# Altium project NA61_BPD_FEE.PrjPcb (part 3 of 4)
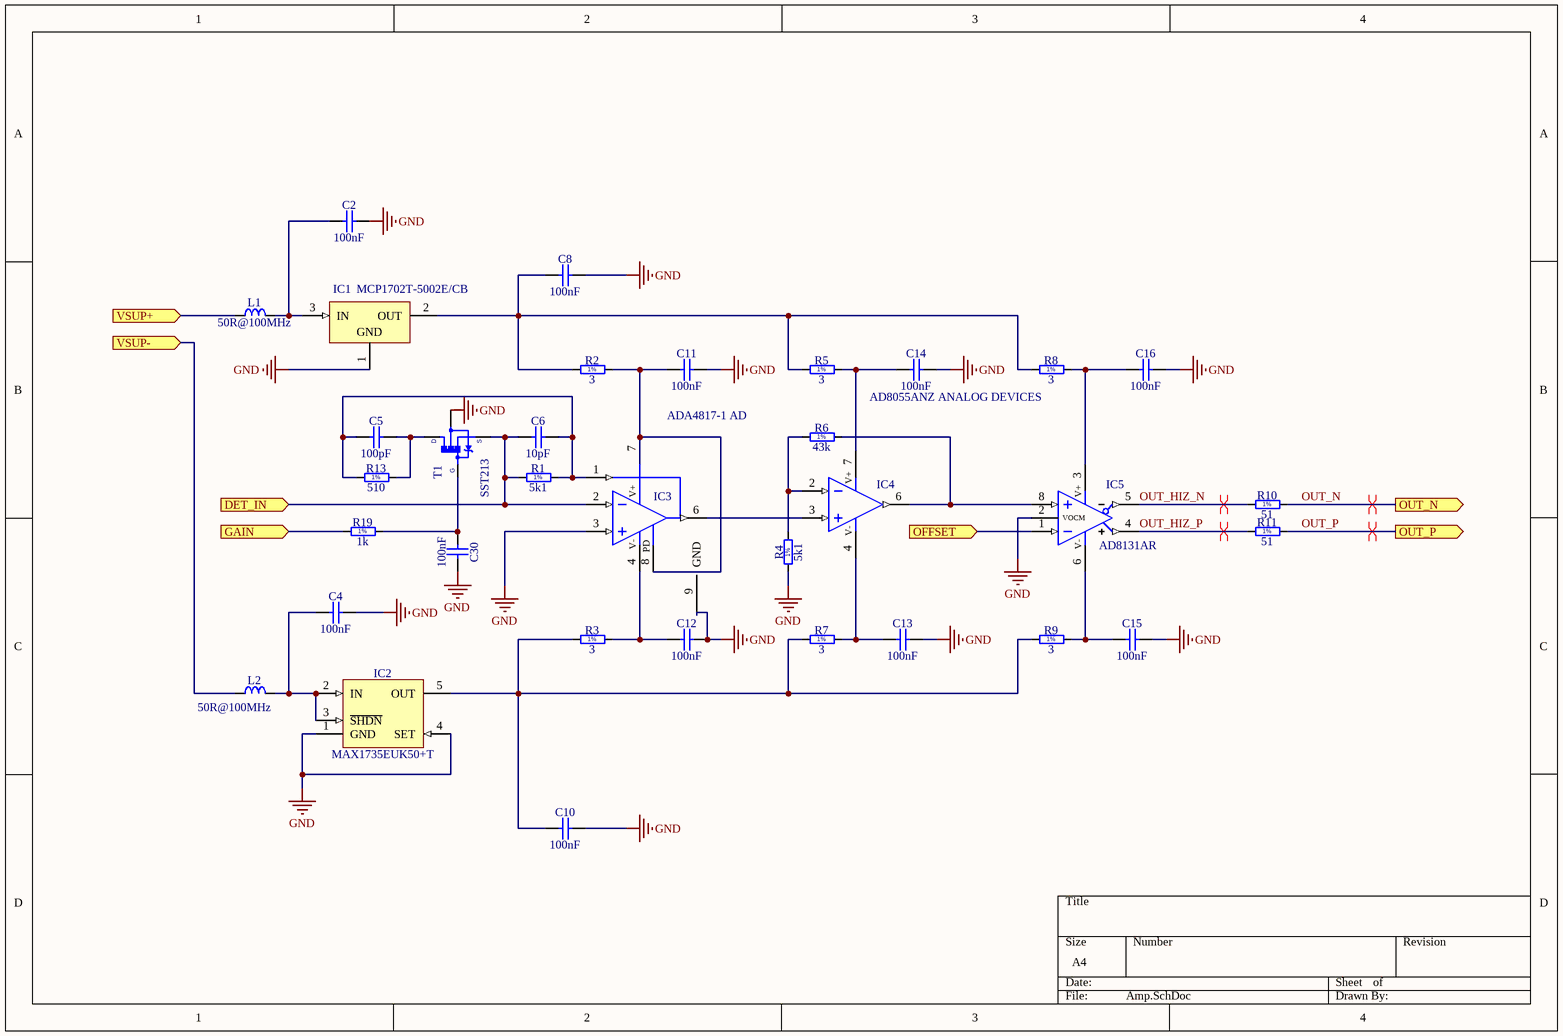
[diagram p3: Amp.SchDoc]
## Nets that join several sheets
CHASSIS: Main (22 pins), U_Bank1 (7 pins), U_Bank2 (7 pins), U_Bank3 (7 pins), U_Bank4 (7 pins), U_Bank5 (7 pins), U_Bank6 (7 pins), U_Bank7 (7 pins), U_Bank8 (7 pins), U_Bank9 (7 pins), U_Bank10 (7 pins), U_Bank11 (7 pins), U_Bank12 (7 pins), U_Bank13 (7 pins), U_Bank14 (7 pins), U_Bank15 (7 pins), U_Bank16 (7 pins), U_Bank17 (7 pins), U_Bank18 (7 pins), U_Bank19 (7 pins), U_Bank20 (7 pins)
GND: Main (51 pins), U_Bank1 (C18_U_Bank1.2 C19_U_Bank1.1 IC6_U_Bank1.4), U_Bank1/U_Amp (19 pins), U_Bank1/U_Amp (19 pins), U_Bank1/U_Amp (19 pins), U_Bank1/U_Amp (19 pins), U_Bank1/U_Amp (19 pins), U_Bank2 (C18_U_Bank2.2 C19_U_Bank2.1 IC6_U_Bank2.4), U_Bank2/U_Amp (19 pins), U_Bank2/U_Amp (19 pins), U_Bank2/U_Amp (19 pins), U_Bank2/U_Amp (19 pins), U_Bank2/U_Amp (19 pins), U_Bank3 (C18_U_Bank3.2 C19_U_Bank3.1 IC6_U_Bank3.4), U_Bank3/U_Amp (19 pins), U_Bank3/U_Amp (19 pins), U_Bank3/U_Amp (19 pins), U_Bank3/U_Amp (19 pins), U_Bank3/U_Amp (19 pins), U_Bank4 (C18_U_Bank4.2 C19_U_Bank4.1 IC6_U_Bank4.4), U_Bank4/U_Amp (19 pins), U_Bank4/U_Amp (19 pins), U_Bank4/U_Amp (19 pins), U_Bank4/U_Amp (19 pins), U_Bank4/U_Amp (19 pins), U_Bank5 (C18_U_Bank5.2 C19_U_Bank5.1 IC6_U_Bank5.4), U_Bank5/U_Amp (19 pins), U_Bank5/U_Amp (19 pins), U_Bank5/U_Amp (19 pins), U_Bank5/U_Amp (19 pins), U_Bank5/U_Amp (19 pins), U_Bank6 (C18_U_Bank6.2 C19_U_Bank6.1 IC6_U_Bank6.4), U_Bank6/U_Amp (19 pins), U_Bank6/U_Amp (19 pins), U_Bank6/U_Amp (19 pins), U_Bank6/U_Amp (19 pins), U_Bank6/U_Amp (19 pins), U_Bank7 (C18_U_Bank7.2 C19_U_Bank7.1 IC6_U_Bank7.4), U_Bank7/U_Amp (19 pins), U_Bank7/U_Amp (19 pins), U_Bank7/U_Amp (19 pins), U_Bank7/U_Amp (19 pins), U_Bank7/U_Amp (19 pins), U_Bank8 (C18_U_Bank8.2 C19_U_Bank8.1 IC6_U_Bank8.4), U_Bank8/U_Amp (19 pins), U_Bank8/U_Amp (19 pins), U_Bank8/U_Amp (19 pins), U_Bank8/U_Amp (19 pins), U_Bank8/U_Amp (19 pins), U_Bank9 (C18_U_Bank9.2 C19_U_Bank9.1 IC6_U_Bank9.4), U_Bank9/U_Amp (19 pins), U_Bank9/U_Amp (19 pins), U_Bank9/U_Amp (19 pins), U_Bank9/U_Amp (19 pins), U_Bank9/U_Amp (19 pins), U_Bank10 (C18_U_Bank10.2 C19_U_Bank10.1 IC6_U_Bank10.4), U_Bank10/U_Amp (19 pins), U_Bank10/U_Amp (19 pins), U_Bank10/U_Amp (19 pins), U_Bank10/U_Amp (19 pins), U_Bank10/U_Amp (19 pins), U_Bank11 (C18_U_Bank11.2 C19_U_Bank11.1 IC6_U_Bank11.4), U_Bank11/U_Amp (19 pins), U_Bank11/U_Amp (19 pins), U_Bank11/U_Amp (19 pins), U_Bank11/U_Amp (19 pins), U_Bank11/U_Amp (19 pins), U_Bank12 (C18_U_Bank12.2 C19_U_Bank12.1 IC6_U_Bank12.4), U_Bank12/U_Amp (19 pins), U_Bank12/U_Amp (19 pins), U_Bank12/U_Amp (19 pins), U_Bank12/U_Amp (19 pins), U_Bank12/U_Amp (19 pins), U_Bank13 (C18_U_Bank13.2 C19_U_Bank13.1 IC6_U_Bank13.4), U_Bank13/U_Amp (19 pins), U_Bank13/U_Amp (19 pins), U_Bank13/U_Amp (19 pins), U_Bank13/U_Amp (19 pins), U_Bank13/U_Amp (19 pins), U_Bank14 (C18_U_Bank14.2 C19_U_Bank14.1 IC6_U_Bank14.4), U_Bank14/U_Amp (19 pins), U_Bank14/U_Amp (19 pins), U_Bank14/U_Amp (19 pins), U_Bank14/U_Amp (19 pins), U_Bank14/U_Amp (19 pins), U_Bank15 (C18_U_Bank15.2 C19_U_Bank15.1 IC6_U_Bank15.4), U_Bank15/U_Amp (19 pins), U_Bank15/U_Amp (19 pins), U_Bank15/U_Amp (19 pins), U_Bank15/U_Amp (19 pins), U_Bank15/U_Amp (19 pins), U_Bank16 (C18_U_Bank16.2 C19_U_Bank16.1 IC6_U_Bank16.4), U_Bank16/U_Amp (19 pins), U_Bank16/U_Amp (19 pins), U_Bank16/U_Amp (19 pins), U_Bank16/U_Amp (19 pins), U_Bank16/U_Amp (19 pins), U_Bank17 (C18_U_Bank17.2 C19_U_Bank17.1 IC6_U_Bank17.4), U_Bank17/U_Amp (19 pins), U_Bank17/U_Amp (19 pins), U_Bank17/U_Amp (19 pins), U_Bank17/U_Amp (19 pins), U_Bank17/U_Amp (19 pins), U_Bank18 (C18_U_Bank18.2 C19_U_Bank18.1 IC6_U_Bank18.4), U_Bank18/U_Amp (19 pins), U_Bank18/U_Amp (19 pins), U_Bank18/U_Amp (19 pins), U_Bank18/U_Amp (19 pins), U_Bank18/U_Amp (19 pins), U_Bank19 (C18_U_Bank19.2 C19_U_Bank19.1 IC6_U_Bank19.4), U_Bank19/U_Amp (19 pins), U_Bank19/U_Amp (19 pins), U_Bank19/U_Amp (19 pins), U_Bank19/U_Amp (19 pins), U_Bank19/U_Amp (19 pins), U_Bank20 (C18_U_Bank20.2 C19_U_Bank20.1 IC6_U_Bank20.4), U_Bank20/U_Amp (19 pins), U_Bank20/U_Amp (19 pins), U_Bank20/U_Amp (19 pins), U_Bank20/U_Amp (19 pins), U_Bank20/U_Amp (19 pins)
+VSUP: Main (9 pins), U_Bank1 (C18_U_Bank1.1 IC6_U_Bank1.7), U_Bank1/U_Amp (L1_U_Amp5.1), U_Bank1/U_Amp (L1_U_Amp4.1), U_Bank1/U_Amp (L1_U_Amp3.1), U_Bank1/U_Amp (L1_U_Amp2.1), U_Bank1/U_Amp (L1_U_Amp1.1), U_Bank2 (C18_U_Bank2.1 IC6_U_Bank2.7), U_Bank2/U_Amp (L1_U_Bank2_U_Amp#1.1), U_Bank2/U_Amp (L1_U_Bank2_U_Amp#2.1), U_Bank2/U_Amp (L1_U_Bank2_U_Amp#3.1), U_Bank2/U_Amp (L1_U_Bank2_U_Amp#4.1), U_Bank2/U_Amp (L1_U_Bank2_U_Amp#5.1), U_Bank3 (C18_U_Bank3.1 IC6_U_Bank3.7), U_Bank3/U_Amp (L1_U_Bank3_U_Amp#1.1), U_Bank3/U_Amp (L1_U_Bank3_U_Amp#2.1), U_Bank3/U_Amp (L1_U_Bank3_U_Amp#3.1), U_Bank3/U_Amp (L1_U_Bank3_U_Amp#4.1), U_Bank3/U_Amp (L1_U_Bank3_U_Amp#5.1), U_Bank4 (C18_U_Bank4.1 IC6_U_Bank4.7), U_Bank4/U_Amp (L1_U_Bank4_U_Amp#1.1), U_Bank4/U_Amp (L1_U_Bank4_U_Amp#2.1), U_Bank4/U_Amp (L1_U_Bank4_U_Amp#3.1), U_Bank4/U_Amp (L1_U_Bank4_U_Amp#4.1), U_Bank4/U_Amp (L1_U_Bank4_U_Amp#5.1), U_Bank5 (C18_U_Bank5.1 IC6_U_Bank5.7), U_Bank5/U_Amp (L1_U_Bank5_U_Amp#1.1), U_Bank5/U_Amp (L1_U_Bank5_U_Amp#2.1), U_Bank5/U_Amp (L1_U_Bank5_U_Amp#3.1), U_Bank5/U_Amp (L1_U_Bank5_U_Amp#4.1), U_Bank5/U_Amp (L1_U_Bank5_U_Amp#5.1), U_Bank6 (C18_U_Bank6.1 IC6_U_Bank6.7), U_Bank6/U_Amp (L1_U_Bank6_U_Amp#1.1), U_Bank6/U_Amp (L1_U_Bank6_U_Amp#2.1), U_Bank6/U_Amp (L1_U_Bank6_U_Amp#3.1), U_Bank6/U_Amp (L1_U_Bank6_U_Amp#4.1), U_Bank6/U_Amp (L1_U_Bank6_U_Amp#5.1), U_Bank7 (C18_U_Bank7.1 IC6_U_Bank7.7), U_Bank7/U_Amp (L1_U_Bank7_U_Amp#1.1), U_Bank7/U_Amp (L1_U_Bank7_U_Amp#2.1), U_Bank7/U_Amp (L1_U_Bank7_U_Amp#3.1), U_Bank7/U_Amp (L1_U_Bank7_U_Amp#4.1), U_Bank7/U_Amp (L1_U_Bank7_U_Amp#5.1), U_Bank8 (C18_U_Bank8.1 IC6_U_Bank8.7), U_Bank8/U_Amp (L1_U_Bank8_U_Amp#1.1), U_Bank8/U_Amp (L1_U_Bank8_U_Amp#2.1), U_Bank8/U_Amp (L1_U_Bank8_U_Amp#3.1), U_Bank8/U_Amp (L1_U_Bank8_U_Amp#4.1), U_Bank8/U_Amp (L1_U_Bank8_U_Amp#5.1), U_Bank9 (C18_U_Bank9.1 IC6_U_Bank9.7), U_Bank9/U_Amp (L1_U_Bank9_U_Amp#1.1), U_Bank9/U_Amp (L1_U_Bank9_U_Amp#2.1), U_Bank9/U_Amp (L1_U_Bank9_U_Amp#3.1), U_Bank9/U_Amp (L1_U_Bank9_U_Amp#4.1), U_Bank9/U_Amp (L1_U_Bank9_U_Amp#5.1), U_Bank10 (C18_U_Bank10.1 IC6_U_Bank10.7), U_Bank10/U_Amp (L1_U_Bank10_U_Amp#1.1), U_Bank10/U_Amp (L1_U_Bank10_U_Amp#2.1), U_Bank10/U_Amp (L1_U_Bank10_U_Amp#3.1), U_Bank10/U_Amp (L1_U_Bank10_U_Amp#4.1), U_Bank10/U_Amp (L1_U_Bank10_U_Amp#5.1), U_Bank11 (C18_U_Bank11.1 IC6_U_Bank11.7), U_Bank11/U_Amp (L1_U_Bank11_U_Amp#1.1), U_Bank11/U_Amp (L1_U_Bank11_U_Amp#2.1), U_Bank11/U_Amp (L1_U_Bank11_U_Amp#3.1), U_Bank11/U_Amp (L1_U_Bank11_U_Amp#4.1), U_Bank11/U_Amp (L1_U_Bank11_U_Amp#5.1), U_Bank12 (C18_U_Bank12.1 IC6_U_Bank12.7), U_Bank12/U_Amp (L1_U_Bank12_U_Amp#1.1), U_Bank12/U_Amp (L1_U_Bank12_U_Amp#2.1), U_Bank12/U_Amp (L1_U_Bank12_U_Amp#3.1), U_Bank12/U_Amp (L1_U_Bank12_U_Amp#4.1), U_Bank12/U_Amp (L1_U_Bank12_U_Amp#5.1), U_Bank13 (C18_U_Bank13.1 IC6_U_Bank13.7), U_Bank13/U_Amp (L1_U_Bank13_U_Amp#1.1), U_Bank13/U_Amp (L1_U_Bank13_U_Amp#2.1), U_Bank13/U_Amp (L1_U_Bank13_U_Amp#3.1), U_Bank13/U_Amp (L1_U_Bank13_U_Amp#4.1), U_Bank13/U_Amp (L1_U_Bank13_U_Amp#5.1), U_Bank14 (C18_U_Bank14.1 IC6_U_Bank14.7), U_Bank14/U_Amp (L1_U_Bank14_U_Amp#1.1), U_Bank14/U_Amp (L1_U_Bank14_U_Amp#2.1), U_Bank14/U_Amp (L1_U_Bank14_U_Amp#3.1), U_Bank14/U_Amp (L1_U_Bank14_U_Amp#4.1), U_Bank14/U_Amp (L1_U_Bank14_U_Amp#5.1), U_Bank15 (C18_U_Bank15.1 IC6_U_Bank15.7), U_Bank15/U_Amp (L1_U_Bank15_U_Amp#1.1), U_Bank15/U_Amp (L1_U_Bank15_U_Amp#2.1), U_Bank15/U_Amp (L1_U_Bank15_U_Amp#3.1), U_Bank15/U_Amp (L1_U_Bank15_U_Amp#4.1), U_Bank15/U_Amp (L1_U_Bank15_U_Amp#5.1), U_Bank16 (C18_U_Bank16.1 IC6_U_Bank16.7), U_Bank16/U_Amp (L1_U_Bank16_U_Amp#1.1), U_Bank16/U_Amp (L1_U_Bank16_U_Amp#2.1), U_Bank16/U_Amp (L1_U_Bank16_U_Amp#3.1), U_Bank16/U_Amp (L1_U_Bank16_U_Amp#4.1), U_Bank16/U_Amp (L1_U_Bank16_U_Amp#5.1), U_Bank17 (C18_U_Bank17.1 IC6_U_Bank17.7), U_Bank17/U_Amp (L1_U_Bank17_U_Amp#1.1), U_Bank17/U_Amp (L1_U_Bank17_U_Amp#2.1), U_Bank17/U_Amp (L1_U_Bank17_U_Amp#3.1), U_Bank17/U_Amp (L1_U_Bank17_U_Amp#4.1), U_Bank17/U_Amp (L1_U_Bank17_U_Amp#5.1), U_Bank18 (C18_U_Bank18.1 IC6_U_Bank18.7), U_Bank18/U_Amp (L1_U_Bank18_U_Amp#1.1), U_Bank18/U_Amp (L1_U_Bank18_U_Amp#2.1), U_Bank18/U_Amp (L1_U_Bank18_U_Amp#3.1), U_Bank18/U_Amp (L1_U_Bank18_U_Amp#4.1), U_Bank18/U_Amp (L1_U_Bank18_U_Amp#5.1), U_Bank19 (C18_U_Bank19.1 IC6_U_Bank19.7), U_Bank19/U_Amp (L1_U_Bank19_U_Amp#1.1), U_Bank19/U_Amp (L1_U_Bank19_U_Amp#2.1), U_Bank19/U_Amp (L1_U_Bank19_U_Amp#3.1), U_Bank19/U_Amp (L1_U_Bank19_U_Amp#4.1), U_Bank19/U_Amp (L1_U_Bank19_U_Amp#5.1), U_Bank20 (C18_U_Bank20.1 IC6_U_Bank20.7), U_Bank20/U_Amp (L1_U_Bank20_U_Amp#1.1), U_Bank20/U_Amp (L1_U_Bank20_U_Amp#2.1), U_Bank20/U_Amp (L1_U_Bank20_U_Amp#3.1), U_Bank20/U_Amp (L1_U_Bank20_U_Amp#4.1), U_Bank20/U_Amp (L1_U_Bank20_U_Amp#5.1)
-VSUP: Main (7 pins), U_Bank1/U_Amp (L2_U_Amp5.1), U_Bank1/U_Amp (L2_U_Amp4.1), U_Bank1/U_Amp (L2_U_Amp3.1), U_Bank1/U_Amp (L2_U_Amp2.1), U_Bank1/U_Amp (L2_U_Amp1.1), U_Bank2/U_Amp (L2_U_Bank2_U_Amp#1.1), U_Bank2/U_Amp (L2_U_Bank2_U_Amp#2.1), U_Bank2/U_Amp (L2_U_Bank2_U_Amp#3.1), U_Bank2/U_Amp (L2_U_Bank2_U_Amp#4.1), U_Bank2/U_Amp (L2_U_Bank2_U_Amp#5.1), U_Bank3/U_Amp (L2_U_Bank3_U_Amp#1.1), U_Bank3/U_Amp (L2_U_Bank3_U_Amp#2.1), U_Bank3/U_Amp (L2_U_Bank3_U_Amp#3.1), U_Bank3/U_Amp (L2_U_Bank3_U_Amp#4.1), U_Bank3/U_Amp (L2_U_Bank3_U_Amp#5.1), U_Bank4/U_Amp (L2_U_Bank4_U_Amp#1.1), U_Bank4/U_Amp (L2_U_Bank4_U_Amp#2.1), U_Bank4/U_Amp (L2_U_Bank4_U_Amp#3.1), U_Bank4/U_Amp (L2_U_Bank4_U_Amp#4.1), U_Bank4/U_Amp (L2_U_Bank4_U_Amp#5.1), U_Bank5/U_Amp (L2_U_Bank5_U_Amp#1.1), U_Bank5/U_Amp (L2_U_Bank5_U_Amp#2.1), U_Bank5/U_Amp (L2_U_Bank5_U_Amp#3.1), U_Bank5/U_Amp (L2_U_Bank5_U_Amp#4.1), U_Bank5/U_Amp (L2_U_Bank5_U_Amp#5.1), U_Bank6/U_Amp (L2_U_Bank6_U_Amp#1.1), U_Bank6/U_Amp (L2_U_Bank6_U_Amp#2.1), U_Bank6/U_Amp (L2_U_Bank6_U_Amp#3.1), U_Bank6/U_Amp (L2_U_Bank6_U_Amp#4.1), U_Bank6/U_Amp (L2_U_Bank6_U_Amp#5.1), U_Bank7/U_Amp (L2_U_Bank7_U_Amp#1.1), U_Bank7/U_Amp (L2_U_Bank7_U_Amp#2.1), U_Bank7/U_Amp (L2_U_Bank7_U_Amp#3.1), U_Bank7/U_Amp (L2_U_Bank7_U_Amp#4.1), U_Bank7/U_Amp (L2_U_Bank7_U_Amp#5.1), U_Bank8/U_Amp (L2_U_Bank8_U_Amp#1.1), U_Bank8/U_Amp (L2_U_Bank8_U_Amp#2.1), U_Bank8/U_Amp (L2_U_Bank8_U_Amp#3.1), U_Bank8/U_Amp (L2_U_Bank8_U_Amp#4.1), U_Bank8/U_Amp (L2_U_Bank8_U_Amp#5.1), U_Bank9/U_Amp (L2_U_Bank9_U_Amp#1.1), U_Bank9/U_Amp (L2_U_Bank9_U_Amp#2.1), U_Bank9/U_Amp (L2_U_Bank9_U_Amp#3.1), U_Bank9/U_Amp (L2_U_Bank9_U_Amp#4.1), U_Bank9/U_Amp (L2_U_Bank9_U_Amp#5.1), U_Bank10/U_Amp (L2_U_Bank10_U_Amp#1.1), U_Bank10/U_Amp (L2_U_Bank10_U_Amp#2.1), U_Bank10/U_Amp (L2_U_Bank10_U_Amp#3.1), U_Bank10/U_Amp (L2_U_Bank10_U_Amp#4.1), U_Bank10/U_Amp (L2_U_Bank10_U_Amp#5.1), U_Bank11/U_Amp (L2_U_Bank11_U_Amp#1.1), U_Bank11/U_Amp (L2_U_Bank11_U_Amp#2.1), U_Bank11/U_Amp (L2_U_Bank11_U_Amp#3.1), U_Bank11/U_Amp (L2_U_Bank11_U_Amp#4.1), U_Bank11/U_Amp (L2_U_Bank11_U_Amp#5.1), U_Bank12/U_Amp (L2_U_Bank12_U_Amp#1.1), U_Bank12/U_Amp (L2_U_Bank12_U_Amp#2.1), U_Bank12/U_Amp (L2_U_Bank12_U_Amp#3.1), U_Bank12/U_Amp (L2_U_Bank12_U_Amp#4.1), U_Bank12/U_Amp (L2_U_Bank12_U_Amp#5.1), U_Bank13/U_Amp (L2_U_Bank13_U_Amp#1.1), U_Bank13/U_Amp (L2_U_Bank13_U_Amp#2.1), U_Bank13/U_Amp (L2_U_Bank13_U_Amp#3.1), U_Bank13/U_Amp (L2_U_Bank13_U_Amp#4.1), U_Bank13/U_Amp (L2_U_Bank13_U_Amp#5.1), U_Bank14/U_Amp (L2_U_Bank14_U_Amp#1.1), U_Bank14/U_Amp (L2_U_Bank14_U_Amp#2.1), U_Bank14/U_Amp (L2_U_Bank14_U_Amp#3.1), U_Bank14/U_Amp (L2_U_Bank14_U_Amp#4.1), U_Bank14/U_Amp (L2_U_Bank14_U_Amp#5.1), U_Bank15/U_Amp (L2_U_Bank15_U_Amp#1.1), U_Bank15/U_Amp (L2_U_Bank15_U_Amp#2.1), U_Bank15/U_Amp (L2_U_Bank15_U_Amp#3.1), U_Bank15/U_Amp (L2_U_Bank15_U_Amp#4.1), U_Bank15/U_Amp (L2_U_Bank15_U_Amp#5.1), U_Bank16/U_Amp (L2_U_Bank16_U_Amp#1.1), U_Bank16/U_Amp (L2_U_Bank16_U_Amp#2.1), U_Bank16/U_Amp (L2_U_Bank16_U_Amp#3.1), U_Bank16/U_Amp (L2_U_Bank16_U_Amp#4.1), U_Bank16/U_Amp (L2_U_Bank16_U_Amp#5.1), U_Bank17/U_Amp (L2_U_Bank17_U_Amp#1.1), U_Bank17/U_Amp (L2_U_Bank17_U_Amp#2.1), U_Bank17/U_Amp (L2_U_Bank17_U_Amp#3.1), U_Bank17/U_Amp (L2_U_Bank17_U_Amp#4.1), U_Bank17/U_Amp (L2_U_Bank17_U_Amp#5.1), U_Bank18/U_Amp (L2_U_Bank18_U_Amp#1.1), U_Bank18/U_Amp (L2_U_Bank18_U_Amp#2.1), U_Bank18/U_Amp (L2_U_Bank18_U_Amp#3.1), U_Bank18/U_Amp (L2_U_Bank18_U_Amp#4.1), U_Bank18/U_Amp (L2_U_Bank18_U_Amp#5.1), U_Bank19/U_Amp (L2_U_Bank19_U_Amp#1.1), U_Bank19/U_Amp (L2_U_Bank19_U_Amp#2.1), U_Bank19/U_Amp (L2_U_Bank19_U_Amp#3.1), U_Bank19/U_Amp (L2_U_Bank19_U_Amp#4.1), U_Bank19/U_Amp (L2_U_Bank19_U_Amp#5.1), U_Bank20/U_Amp (L2_U_Bank20_U_Amp#1.1), U_Bank20/U_Amp (L2_U_Bank20_U_Amp#2.1), U_Bank20/U_Amp (L2_U_Bank20_U_Amp#3.1), U_Bank20/U_Amp (L2_U_Bank20_U_Amp#4.1), U_Bank20/U_Amp (L2_U_Bank20_U_Amp#5.1)
DET_IN_A: Main (XP1.91), U_Bank1/U_Amp (C6_U_Amp5.1 IC3_U_Amp5.2 R1_U_Amp5.1 T1_U_Amp5.2)
DET_IN_A: Main (XP1.17), U_Bank2/U_Amp (C6_U_Bank2_U_Amp#1.1 IC3_U_Bank2_U_Amp#1.2 R1_U_Bank2_U_Amp#1.1 T1_U_Bank2_U_Amp#1.2)
DET_IN_A: Main (XP1.82), U_Bank3/U_Amp (C6_U_Bank3_U_Amp#1.1 IC3_U_Bank3_U_Amp#1.2 R1_U_Bank3_U_Amp#1.1 T1_U_Bank3_U_Amp#1.2)
DET_IN_A: Main (XP1.12), U_Bank4/U_Amp (C6_U_Bank4_U_Amp#1.1 IC3_U_Bank4_U_Amp#1.2 R1_U_Bank4_U_Amp#1.1 T1_U_Bank4_U_Amp#1.2)
DET_IN_A: Main (XP1.49), U_Bank5/U_Amp (C6_U_Bank5_U_Amp#1.1 IC3_U_Bank5_U_Amp#1.2 R1_U_Bank5_U_Amp#1.1 T1_U_Bank5_U_Amp#1.2)
DET_IN_A: Main (XP1.31), U_Bank6/U_Amp (C6_U_Bank6_U_Amp#1.1 IC3_U_Bank6_U_Amp#1.2 R1_U_Bank6_U_Amp#1.1 T1_U_Bank6_U_Amp#1.2)
DET_IN_A: Main (XP1.69), U_Bank7/U_Amp (C6_U_Bank7_U_Amp#1.1 IC3_U_Bank7_U_Amp#1.2 R1_U_Bank7_U_Amp#1.1 T1_U_Bank7_U_Amp#1.2)
DET_IN_A: Main (XP1.6), U_Bank8/U_Amp (C6_U_Bank8_U_Amp#1.1 IC3_U_Bank8_U_Amp#1.2 R1_U_Bank8_U_Amp#1.1 T1_U_Bank8_U_Amp#1.2)
DET_IN_A: Main (XP1.97), U_Bank9/U_Amp (C6_U_Bank9_U_Amp#1.1 IC3_U_Bank9_U_Amp#1.2 R1_U_Bank9_U_Amp#1.1 T1_U_Bank9_U_Amp#1.2)
DET_IN_A: Main (XP1.1), U_Bank10/U_Amp (C6_U_Bank10_U_Amp#1.1 IC3_U_Bank10_U_Amp#1.2 R1_U_Bank10_U_Amp#1.1 T1_U_Bank10_U_Amp#1.2)
DET_IN_A: Main (XP1.41), U_Bank11/U_Amp (C6_U_Bank11_U_Amp#1.1 IC3_U_Bank11_U_Amp#1.2 R1_U_Bank11_U_Amp#1.1 T1_U_Bank11_U_Amp#1.2)
DET_IN_A: Main (XP1.40), U_Bank12/U_Amp (C6_U_Bank12_U_Amp#1.1 IC3_U_Bank12_U_Amp#1.2 R1_U_Bank12_U_Amp#1.1 T1_U_Bank12_U_Amp#1.2)
DET_IN_A: Main (XP1.36), U_Bank13/U_Amp (C6_U_Bank13_U_Amp#1.1 IC3_U_Bank13_U_Amp#1.2 R1_U_Bank13_U_Amp#1.1 T1_U_Bank13_U_Amp#1.2)
DET_IN_A: Main (XP1.35), U_Bank14/U_Amp (C6_U_Bank14_U_Amp#1.1 IC3_U_Bank14_U_Amp#1.2 R1_U_Bank14_U_Amp#1.1 T1_U_Bank14_U_Amp#1.2)
DET_IN_A: Main (XP1.55), U_Bank15/U_Amp (C6_U_Bank15_U_Amp#1.1 IC3_U_Bank15_U_Amp#1.2 R1_U_Bank15_U_Amp#1.1 T1_U_Bank15_U_Amp#1.2)
DET_IN_A: Main (XP1.54), U_Bank16/U_Amp (C6_U_Bank16_U_Amp#1.1 IC3_U_Bank16_U_Amp#1.2 R1_U_Bank16_U_Amp#1.1 T1_U_Bank16_U_Amp#1.2)
DET_IN_A: Main (XP1.50), U_Bank17/U_Amp (C6_U_Bank17_U_Amp#1.1 IC3_U_Bank17_U_Amp#1.2 R1_U_Bank17_U_Amp#1.1 T1_U_Bank17_U_Amp#1.2)
DET_IN_A: Main (XP1.29), U_Bank18/U_Amp (C6_U_Bank18_U_Amp#1.1 IC3_U_Bank18_U_Amp#1.2 R1_U_Bank18_U_Amp#1.1 T1_U_Bank18_U_Amp#1.2)
DET_IN_A: Main (XP1.25), U_Bank19/U_Amp (C6_U_Bank19_U_Amp#1.1 IC3_U_Bank19_U_Amp#1.2 R1_U_Bank19_U_Amp#1.1 T1_U_Bank19_U_Amp#1.2)
DET_IN_A: Main (XP1.24), U_Bank20/U_Amp (C6_U_Bank20_U_Amp#1.1 IC3_U_Bank20_U_Amp#1.2 R1_U_Bank20_U_Amp#1.1 T1_U_Bank20_U_Amp#1.2)
DET_IN_B: Main (XP1.21), U_Bank1/U_Amp (C6_U_Amp4.1 IC3_U_Amp4.2 R1_U_Amp4.1 T1_U_Amp4.2)
DET_IN_B: Main (XP1.19), U_Bank2/U_Amp (C6_U_Bank2_U_Amp#2.1 IC3_U_Bank2_U_Amp#2.2 R1_U_Bank2_U_Amp#2.1 T1_U_Bank2_U_Amp#2.2)
DET_IN_B: Main (XP1.16), U_Bank3/U_Amp (C6_U_Bank3_U_Amp#2.1 IC3_U_Bank3_U_Amp#2.2 R1_U_Bank3_U_Amp#2.1 T1_U_Bank3_U_Amp#2.2)
DET_IN_B: Main (XP1.14), U_Bank4/U_Amp (C6_U_Bank4_U_Amp#2.1 IC3_U_Bank4_U_Amp#2.2 R1_U_Bank4_U_Amp#2.1 T1_U_Bank4_U_Amp#2.2)
DET_IN_B: Main (XP1.11), U_Bank5/U_Amp (C6_U_Bank5_U_Amp#2.1 IC3_U_Bank5_U_Amp#2.2 R1_U_Bank5_U_Amp#2.1 T1_U_Bank5_U_Amp#2.2)
DET_IN_B: Main (XP1.33), U_Bank6/U_Amp (C6_U_Bank6_U_Amp#2.1 IC3_U_Bank6_U_Amp#2.2 R1_U_Bank6_U_Amp#2.1 T1_U_Bank6_U_Amp#2.2)
DET_IN_B: Main (XP1.9), U_Bank7/U_Amp (C6_U_Bank7_U_Amp#2.1 IC3_U_Bank7_U_Amp#2.2 R1_U_Bank7_U_Amp#2.1 T1_U_Bank7_U_Amp#2.2)
DET_IN_B: Main (XP1.8), U_Bank8/U_Amp (C6_U_Bank8_U_Amp#2.1 IC3_U_Bank8_U_Amp#2.2 R1_U_Bank8_U_Amp#2.1 T1_U_Bank8_U_Amp#2.2)
DET_IN_B: Main (XP1.5), U_Bank9/U_Amp (C6_U_Bank9_U_Amp#2.1 IC3_U_Bank9_U_Amp#2.2 R1_U_Bank9_U_Amp#2.1 T1_U_Bank9_U_Amp#2.2)
DET_IN_B: Main (XP1.3), U_Bank10/U_Amp (C6_U_Bank10_U_Amp#2.1 IC3_U_Bank10_U_Amp#2.2 R1_U_Bank10_U_Amp#2.1 T1_U_Bank10_U_Amp#2.2)
DET_IN_B: Main (XP1.90), U_Bank11/U_Amp (C6_U_Bank11_U_Amp#2.1 IC3_U_Bank11_U_Amp#2.2 R1_U_Bank11_U_Amp#2.1 T1_U_Bank11_U_Amp#2.2)
DET_IN_B: Main (XP1.38), U_Bank12/U_Amp (C6_U_Bank12_U_Amp#2.1 IC3_U_Bank12_U_Amp#2.2 R1_U_Bank12_U_Amp#2.1 T1_U_Bank12_U_Amp#2.2)
DET_IN_B: Main (XP1.81), U_Bank13/U_Amp (C6_U_Bank13_U_Amp#2.1 IC3_U_Bank13_U_Amp#2.2 R1_U_Bank13_U_Amp#2.1 T1_U_Bank13_U_Amp#2.2)
DET_IN_B: Main (XP1.57), U_Bank14/U_Amp (C6_U_Bank14_U_Amp#2.1 IC3_U_Bank14_U_Amp#2.2 R1_U_Bank14_U_Amp#2.1 T1_U_Bank14_U_Amp#2.2)
DET_IN_B: Main (XP1.48), U_Bank15/U_Amp (C6_U_Bank15_U_Amp#2.1 IC3_U_Bank15_U_Amp#2.2 R1_U_Bank15_U_Amp#2.1 T1_U_Bank15_U_Amp#2.2)
DET_IN_B: Main (XP1.52), U_Bank16/U_Amp (C6_U_Bank16_U_Amp#2.1 IC3_U_Bank16_U_Amp#2.2 R1_U_Bank16_U_Amp#2.1 T1_U_Bank16_U_Amp#2.2)
DET_IN_B: Main (XP1.68), U_Bank17/U_Amp (C6_U_Bank17_U_Amp#2.1 IC3_U_Bank17_U_Amp#2.2 R1_U_Bank17_U_Amp#2.1 T1_U_Bank17_U_Amp#2.2)
DET_IN_B: Main (XP1.27), U_Bank18/U_Amp (C6_U_Bank18_U_Amp#2.1 IC3_U_Bank18_U_Amp#2.2 R1_U_Bank18_U_Amp#2.1 T1_U_Bank18_U_Amp#2.2)
DET_IN_B: Main (XP1.96), U_Bank19/U_Amp (C6_U_Bank19_U_Amp#2.1 IC3_U_Bank19_U_Amp#2.2 R1_U_Bank19_U_Amp#2.1 T1_U_Bank19_U_Amp#2.2)
DET_IN_B: Main (XP1.22), U_Bank20/U_Amp (C6_U_Bank20_U_Amp#2.1 IC3_U_Bank20_U_Amp#2.2 R1_U_Bank20_U_Amp#2.1 T1_U_Bank20_U_Amp#2.2)
DET_IN_C: Main (XP1.20), U_Bank1/U_Amp (C6_U_Amp3.1 IC3_U_Amp3.2 R1_U_Amp3.1 T1_U_Amp3.2)
DET_IN_C: Main (XP1.87), U_Bank2/U_Amp (C6_U_Bank2_U_Amp#3.1 IC3_U_Bank2_U_Amp#3.2 R1_U_Bank2_U_Amp#3.1 T1_U_Bank2_U_Amp#3.2)
DET_IN_C: Main (XP1.15), U_Bank3/U_Amp (C6_U_Bank3_U_Amp#3.1 IC3_U_Bank3_U_Amp#3.2 R1_U_Bank3_U_Amp#3.1 T1_U_Bank3_U_Amp#3.2)
DET_IN_C: Main (XP1.78), U_Bank4/U_Amp (C6_U_Bank4_U_Amp#3.1 IC3_U_Bank4_U_Amp#3.2 R1_U_Bank4_U_Amp#3.1 T1_U_Bank4_U_Amp#3.2)
DET_IN_C: Main (XP1.32), U_Bank5/U_Amp (C6_U_Bank5_U_Amp#3.1 IC3_U_Bank5_U_Amp#3.2 R1_U_Bank5_U_Amp#3.1 T1_U_Bank5_U_Amp#3.2)
DET_IN_C: Main (XP1.45), U_Bank6/U_Amp (C6_U_Bank6_U_Amp#3.1 IC3_U_Bank6_U_Amp#3.2 R1_U_Bank6_U_Amp#3.1 T1_U_Bank6_U_Amp#3.2)
DET_IN_C: Main (XP1.30), U_Bank7/U_Amp (C6_U_Bank7_U_Amp#3.1 IC3_U_Bank7_U_Amp#3.2 R1_U_Bank7_U_Amp#3.1 T1_U_Bank7_U_Amp#3.2)
DET_IN_C: Main (XP1.65), U_Bank8/U_Amp (C6_U_Bank8_U_Amp#3.1 IC3_U_Bank8_U_Amp#3.2 R1_U_Bank8_U_Amp#3.1 T1_U_Bank8_U_Amp#3.2)
DET_IN_C: Main (XP1.4), U_Bank9/U_Amp (C6_U_Bank9_U_Amp#3.1 IC3_U_Bank9_U_Amp#3.2 R1_U_Bank9_U_Amp#3.1 T1_U_Bank9_U_Amp#3.2)
DET_IN_C: Main (XP1.74), U_Bank10/U_Amp (C6_U_Bank10_U_Amp#3.1 IC3_U_Bank10_U_Amp#3.2 R1_U_Bank10_U_Amp#3.1 T1_U_Bank10_U_Amp#3.2)
DET_IN_C: Main (XP1.42), U_Bank11/U_Amp (C6_U_Bank11_U_Amp#3.1 IC3_U_Bank11_U_Amp#3.2 R1_U_Bank11_U_Amp#3.1 T1_U_Bank11_U_Amp#3.2)
DET_IN_C: Main (XP1.39), U_Bank12/U_Amp (C6_U_Bank12_U_Amp#3.1 IC3_U_Bank12_U_Amp#3.2 R1_U_Bank12_U_Amp#3.1 T1_U_Bank12_U_Amp#3.2)
DET_IN_C: Main (XP1.37), U_Bank13/U_Amp (C6_U_Bank13_U_Amp#3.1 IC3_U_Bank13_U_Amp#3.2 R1_U_Bank13_U_Amp#3.1 T1_U_Bank13_U_Amp#3.2)
DET_IN_C: Main (XP1.34), U_Bank14/U_Amp (C6_U_Bank14_U_Amp#3.1 IC3_U_Bank14_U_Amp#3.2 R1_U_Bank14_U_Amp#3.1 T1_U_Bank14_U_Amp#3.2)
DET_IN_C: Main (XP1.56), U_Bank15/U_Amp (C6_U_Bank15_U_Amp#3.1 IC3_U_Bank15_U_Amp#3.2 R1_U_Bank15_U_Amp#3.1 T1_U_Bank15_U_Amp#3.2)
DET_IN_C: Main (XP1.53), U_Bank16/U_Amp (C6_U_Bank16_U_Amp#3.1 IC3_U_Bank16_U_Amp#3.2 R1_U_Bank16_U_Amp#3.1 T1_U_Bank16_U_Amp#3.2)
DET_IN_C: Main (XP1.51), U_Bank17/U_Amp (C6_U_Bank17_U_Amp#3.1 IC3_U_Bank17_U_Amp#3.2 R1_U_Bank17_U_Amp#3.1 T1_U_Bank17_U_Amp#3.2)
DET_IN_C: Main (XP1.28), U_Bank18/U_Amp (C6_U_Bank18_U_Amp#3.1 IC3_U_Bank18_U_Amp#3.2 R1_U_Bank18_U_Amp#3.1 T1_U_Bank18_U_Amp#3.2)
DET_IN_C: Main (XP1.26), U_Bank19/U_Amp (C6_U_Bank19_U_Amp#3.1 IC3_U_Bank19_U_Amp#3.2 R1_U_Bank19_U_Amp#3.1 T1_U_Bank19_U_Amp#3.2)
DET_IN_C: Main (XP1.23), U_Bank20/U_Amp (C6_U_Bank20_U_Amp#3.1 IC3_U_Bank20_U_Amp#3.2 R1_U_Bank20_U_Amp#3.1 T1_U_Bank20_U_Amp#3.2)
DET_IN_D: Main (XP1.75), U_Bank1/U_Amp (C6_U_Amp2.1 IC3_U_Amp2.2 R1_U_Amp2.1 T1_U_Amp2.2)
DET_IN_D: Main (XP1.18), U_Bank2/U_Amp (C6_U_Bank2_U_Amp#4.1 IC3_U_Bank2_U_Amp#4.2 R1_U_Bank2_U_Amp#4.1 T1_U_Bank2_U_Amp#4.2)
DET_IN_D: Main (XP1.85), U_Bank3/U_Amp (C6_U_Bank3_U_Amp#4.1 IC3_U_Bank3_U_Amp#4.2 R1_U_Bank3_U_Amp#4.1 T1_U_Bank3_U_Amp#4.2)
DET_IN_D: Main (XP1.13), U_Bank4/U_Amp (C6_U_Bank4_U_Amp#4.1 IC3_U_Bank4_U_Amp#4.2 R1_U_Bank4_U_Amp#4.1 T1_U_Bank4_U_Amp#4.2)
DET_IN_D: Main (XP1.61), U_Bank5/U_Amp (C6_U_Bank5_U_Amp#4.1 IC3_U_Bank5_U_Amp#4.2 R1_U_Bank5_U_Amp#4.1 T1_U_Bank5_U_Amp#4.2)
DET_IN_D: Main (XP1.10), U_Bank6/U_Amp (C6_U_Bank6_U_Amp#4.1 IC3_U_Bank6_U_Amp#4.2 R1_U_Bank6_U_Amp#4.1 T1_U_Bank6_U_Amp#4.2)
DET_IN_D: Main (XP1.77), U_Bank7/U_Amp (C6_U_Bank7_U_Amp#4.1 IC3_U_Bank7_U_Amp#4.2 R1_U_Bank7_U_Amp#4.1 T1_U_Bank7_U_Amp#4.2)
DET_IN_D: Main (XP1.7), U_Bank8/U_Amp (C6_U_Bank8_U_Amp#4.1 IC3_U_Bank8_U_Amp#4.2 R1_U_Bank8_U_Amp#4.1 T1_U_Bank8_U_Amp#4.2)
DET_IN_D: Main (XP1.64), U_Bank9/U_Amp (C6_U_Bank9_U_Amp#4.1 IC3_U_Bank9_U_Amp#4.2 R1_U_Bank9_U_Amp#4.1 T1_U_Bank9_U_Amp#4.2)
DET_IN_D: Main (XP1.2), U_Bank10/U_Amp (C6_U_Bank10_U_Amp#4.1 IC3_U_Bank10_U_Amp#4.2 R1_U_Bank10_U_Amp#4.1 T1_U_Bank10_U_Amp#4.2)
DET_IN_D: Main (XP1.92), U_Bank11/U_Amp (C6_U_Bank11_U_Amp#4.1 IC3_U_Bank11_U_Amp#4.2 R1_U_Bank11_U_Amp#4.1 T1_U_Bank11_U_Amp#4.2)
DET_IN_D: Main (XP1.86), U_Bank12/U_Amp (C6_U_Bank12_U_Amp#4.1 IC3_U_Bank12_U_Amp#4.2 R1_U_Bank12_U_Amp#4.1 T1_U_Bank12_U_Amp#4.2)
DET_IN_D: Main (XP1.83), U_Bank13/U_Amp (C6_U_Bank13_U_Amp#4.1 IC3_U_Bank13_U_Amp#4.2 R1_U_Bank13_U_Amp#4.1 T1_U_Bank13_U_Amp#4.2)
DET_IN_D: Main (XP1.62), U_Bank14/U_Amp (C6_U_Bank14_U_Amp#4.1 IC3_U_Bank14_U_Amp#4.2 R1_U_Bank14_U_Amp#4.1 T1_U_Bank14_U_Amp#4.2)
DET_IN_D: Main (XP1.58), U_Bank15/U_Amp (C6_U_Bank15_U_Amp#4.1 IC3_U_Bank15_U_Amp#4.2 R1_U_Bank15_U_Amp#4.1 T1_U_Bank15_U_Amp#4.2)
DET_IN_D: Main (XP1.44), U_Bank16/U_Amp (C6_U_Bank16_U_Amp#4.1 IC3_U_Bank16_U_Amp#4.2 R1_U_Bank16_U_Amp#4.1 T1_U_Bank16_U_Amp#4.2)
DET_IN_D: Main (XP1.70), U_Bank17/U_Amp (C6_U_Bank17_U_Amp#4.1 IC3_U_Bank17_U_Amp#4.2 R1_U_Bank17_U_Amp#4.1 T1_U_Bank17_U_Amp#4.2)
DET_IN_D: Main (XP1.43), U_Bank18/U_Amp (C6_U_Bank18_U_Amp#4.1 IC3_U_Bank18_U_Amp#4.2 R1_U_Bank18_U_Amp#4.1 T1_U_Bank18_U_Amp#4.2)
DET_IN_D: Main (XP1.98), U_Bank19/U_Amp (C6_U_Bank19_U_Amp#4.1 IC3_U_Bank19_U_Amp#4.2 R1_U_Bank19_U_Amp#4.1 T1_U_Bank19_U_Amp#4.2)
DET_IN_D: Main (XP1.94), U_Bank20/U_Amp (C6_U_Bank20_U_Amp#4.1 IC3_U_Bank20_U_Amp#4.2 R1_U_Bank20_U_Amp#4.1 T1_U_Bank20_U_Amp#4.2)
DET_IN_E: Main (XP1.76), U_Bank1/U_Amp (C6_U_Amp1.1 IC3_U_Amp1.2 R1_U_Amp1.1 T1_U_Amp1.2)
DET_IN_E: Main (XP1.89), U_Bank2/U_Amp (C6_U_Bank2_U_Amp#5.1 IC3_U_Bank2_U_Amp#5.2 R1_U_Bank2_U_Amp#5.1 T1_U_Bank2_U_Amp#5.2)
DET_IN_E: Main (XP1.84), U_Bank3/U_Amp (C6_U_Bank3_U_Amp#5.1 IC3_U_Bank3_U_Amp#5.2 R1_U_Bank3_U_Amp#5.1 T1_U_Bank3_U_Amp#5.2)
DET_IN_E: Main (XP1.80), U_Bank4/U_Amp (C6_U_Bank4_U_Amp#5.1 IC3_U_Bank4_U_Amp#5.2 R1_U_Bank4_U_Amp#5.1 T1_U_Bank4_U_Amp#5.2)
DET_IN_E: Main (XP1.59), U_Bank5/U_Amp (C6_U_Bank5_U_Amp#5.1 IC3_U_Bank5_U_Amp#5.2 R1_U_Bank5_U_Amp#5.1 T1_U_Bank5_U_Amp#5.2)
DET_IN_E: Main (XP1.47), U_Bank6/U_Amp (C6_U_Bank6_U_Amp#5.1 IC3_U_Bank6_U_Amp#5.2 R1_U_Bank6_U_Amp#5.1 T1_U_Bank6_U_Amp#5.2)
DET_IN_E: Main (XP1.71), U_Bank7/U_Amp (C6_U_Bank7_U_Amp#5.1 IC3_U_Bank7_U_Amp#5.2 R1_U_Bank7_U_Amp#5.1 T1_U_Bank7_U_Amp#5.2)
DET_IN_E: Main (XP1.67), U_Bank8/U_Amp (C6_U_Bank8_U_Amp#5.1 IC3_U_Bank8_U_Amp#5.2 R1_U_Bank8_U_Amp#5.1 T1_U_Bank8_U_Amp#5.2)
DET_IN_E: Main (XP1.99), U_Bank9/U_Amp (C6_U_Bank9_U_Amp#5.1 IC3_U_Bank9_U_Amp#5.2 R1_U_Bank9_U_Amp#5.1 T1_U_Bank9_U_Amp#5.2)
DET_IN_E: Main (XP1.73), U_Bank10/U_Amp (C6_U_Bank10_U_Amp#5.1 IC3_U_Bank10_U_Amp#5.2 R1_U_Bank10_U_Amp#5.1 T1_U_Bank10_U_Amp#5.2)
DET_IN_E: Main (XP1.93), U_Bank11/U_Amp (C6_U_Bank11_U_Amp#5.1 IC3_U_Bank11_U_Amp#5.2 R1_U_Bank11_U_Amp#5.1 T1_U_Bank11_U_Amp#5.2)
DET_IN_E: Main (XP1.88), U_Bank12/U_Amp (C6_U_Bank12_U_Amp#5.1 IC3_U_Bank12_U_Amp#5.2 R1_U_Bank12_U_Amp#5.1 T1_U_Bank12_U_Amp#5.2)
DET_IN_E: Main (XP1.63), U_Bank13/U_Amp (C6_U_Bank13_U_Amp#5.1 IC3_U_Bank13_U_Amp#5.2 R1_U_Bank13_U_Amp#5.1 T1_U_Bank13_U_Amp#5.2)
DET_IN_E: Main (XP1.79), U_Bank14/U_Amp (C6_U_Bank14_U_Amp#5.1 IC3_U_Bank14_U_Amp#5.2 R1_U_Bank14_U_Amp#5.1 T1_U_Bank14_U_Amp#5.2)
DET_IN_E: Main (XP1.60), U_Bank15/U_Amp (C6_U_Bank15_U_Amp#5.1 IC3_U_Bank15_U_Amp#5.2 R1_U_Bank15_U_Amp#5.1 T1_U_Bank15_U_Amp#5.2)
DET_IN_E: Main (XP1.46), U_Bank16/U_Amp (C6_U_Bank16_U_Amp#5.1 IC3_U_Bank16_U_Amp#5.2 R1_U_Bank16_U_Amp#5.1 T1_U_Bank16_U_Amp#5.2)
DET_IN_E: Main (XP1.72), U_Bank17/U_Amp (C6_U_Bank17_U_Amp#5.1 IC3_U_Bank17_U_Amp#5.2 R1_U_Bank17_U_Amp#5.1 T1_U_Bank17_U_Amp#5.2)
DET_IN_E: Main (XP1.66), U_Bank18/U_Amp (C6_U_Bank18_U_Amp#5.1 IC3_U_Bank18_U_Amp#5.2 R1_U_Bank18_U_Amp#5.1 T1_U_Bank18_U_Amp#5.2)
DET_IN_E: Main (XP1.100), U_Bank19/U_Amp (C6_U_Bank19_U_Amp#5.1 IC3_U_Bank19_U_Amp#5.2 R1_U_Bank19_U_Amp#5.1 T1_U_Bank19_U_Amp#5.2)
DET_IN_E: Main (XP1.95), U_Bank20/U_Amp (C6_U_Bank20_U_Amp#5.1 IC3_U_Bank20_U_Amp#5.2 R1_U_Bank20_U_Amp#5.1 T1_U_Bank20_U_Amp#5.2)
NetIC5_U_Amp1_1: U_Bank1 (IC6_U_Bank1.2 IC6_U_Bank1.6), U_Bank1/U_Amp (IC5_U_Amp5.1), U_Bank1/U_Amp (IC5_U_Amp4.1), U_Bank1/U_Amp (IC5_U_Amp3.1), U_Bank1/U_Amp (IC5_U_Amp2.1), U_Bank1/U_Amp (IC5_U_Amp1.1)
NetIC5_U_Bank2_U_Amp#1_1: U_Bank2 (IC6_U_Bank2.2 IC6_U_Bank2.6), U_Bank2/U_Amp (IC5_U_Bank2_U_Amp#1.1), U_Bank2/U_Amp (IC5_U_Bank2_U_Amp#2.1), U_Bank2/U_Amp (IC5_U_Bank2_U_Amp#3.1), U_Bank2/U_Amp (IC5_U_Bank2_U_Amp#4.1), U_Bank2/U_Amp (IC5_U_Bank2_U_Amp#5.1)
NetIC5_U_Bank3_U_Amp#1_1: U_Bank3 (IC6_U_Bank3.2 IC6_U_Bank3.6), U_Bank3/U_Amp (IC5_U_Bank3_U_Amp#1.1), U_Bank3/U_Amp (IC5_U_Bank3_U_Amp#2.1), U_Bank3/U_Amp (IC5_U_Bank3_U_Amp#3.1), U_Bank3/U_Amp (IC5_U_Bank3_U_Amp#4.1), U_Bank3/U_Amp (IC5_U_Bank3_U_Amp#5.1)
NetIC5_U_Bank4_U_Amp#1_1: U_Bank4 (IC6_U_Bank4.2 IC6_U_Bank4.6), U_Bank4/U_Amp (IC5_U_Bank4_U_Amp#1.1), U_Bank4/U_Amp (IC5_U_Bank4_U_Amp#2.1), U_Bank4/U_Amp (IC5_U_Bank4_U_Amp#3.1), U_Bank4/U_Amp (IC5_U_Bank4_U_Amp#4.1), U_Bank4/U_Amp (IC5_U_Bank4_U_Amp#5.1)
NetIC5_U_Bank5_U_Amp#1_1: U_Bank5 (IC6_U_Bank5.2 IC6_U_Bank5.6), U_Bank5/U_Amp (IC5_U_Bank5_U_Amp#1.1), U_Bank5/U_Amp (IC5_U_Bank5_U_Amp#2.1), U_Bank5/U_Amp (IC5_U_Bank5_U_Amp#3.1), U_Bank5/U_Amp (IC5_U_Bank5_U_Amp#4.1), U_Bank5/U_Amp (IC5_U_Bank5_U_Amp#5.1)
NetIC5_U_Bank6_U_Amp#1_1: U_Bank6 (IC6_U_Bank6.2 IC6_U_Bank6.6), U_Bank6/U_Amp (IC5_U_Bank6_U_Amp#1.1), U_Bank6/U_Amp (IC5_U_Bank6_U_Amp#2.1), U_Bank6/U_Amp (IC5_U_Bank6_U_Amp#3.1), U_Bank6/U_Amp (IC5_U_Bank6_U_Amp#4.1), U_Bank6/U_Amp (IC5_U_Bank6_U_Amp#5.1)
NetIC5_U_Bank7_U_Amp#1_1: U_Bank7 (IC6_U_Bank7.2 IC6_U_Bank7.6), U_Bank7/U_Amp (IC5_U_Bank7_U_Amp#1.1), U_Bank7/U_Amp (IC5_U_Bank7_U_Amp#2.1), U_Bank7/U_Amp (IC5_U_Bank7_U_Amp#3.1), U_Bank7/U_Amp (IC5_U_Bank7_U_Amp#4.1), U_Bank7/U_Amp (IC5_U_Bank7_U_Amp#5.1)
NetIC5_U_Bank8_U_Amp#1_1: U_Bank8 (IC6_U_Bank8.2 IC6_U_Bank8.6), U_Bank8/U_Amp (IC5_U_Bank8_U_Amp#1.1), U_Bank8/U_Amp (IC5_U_Bank8_U_Amp#2.1), U_Bank8/U_Amp (IC5_U_Bank8_U_Amp#3.1), U_Bank8/U_Amp (IC5_U_Bank8_U_Amp#4.1), U_Bank8/U_Amp (IC5_U_Bank8_U_Amp#5.1)
NetIC5_U_Bank9_U_Amp#1_1: U_Bank9 (IC6_U_Bank9.2 IC6_U_Bank9.6), U_Bank9/U_Amp (IC5_U_Bank9_U_Amp#1.1), U_Bank9/U_Amp (IC5_U_Bank9_U_Amp#2.1), U_Bank9/U_Amp (IC5_U_Bank9_U_Amp#3.1), U_Bank9/U_Amp (IC5_U_Bank9_U_Amp#4.1), U_Bank9/U_Amp (IC5_U_Bank9_U_Amp#5.1)
NetIC5_U_Bank10_U_Amp#1_1: U_Bank10 (IC6_U_Bank10.2 IC6_U_Bank10.6), U_Bank10/U_Amp (IC5_U_Bank10_U_Amp#1.1), U_Bank10/U_Amp (IC5_U_Bank10_U_Amp#2.1), U_Bank10/U_Amp (IC5_U_Bank10_U_Amp#3.1), U_Bank10/U_Amp (IC5_U_Bank10_U_Amp#4.1), U_Bank10/U_Amp (IC5_U_Bank10_U_Amp#5.1)
NetIC5_U_Bank11_U_Amp#1_1: U_Bank11 (IC6_U_Bank11.2 IC6_U_Bank11.6), U_Bank11/U_Amp (IC5_U_Bank11_U_Amp#1.1), U_Bank11/U_Amp (IC5_U_Bank11_U_Amp#2.1), U_Bank11/U_Amp (IC5_U_Bank11_U_Amp#3.1), U_Bank11/U_Amp (IC5_U_Bank11_U_Amp#4.1), U_Bank11/U_Amp (IC5_U_Bank11_U_Amp#5.1)
NetIC5_U_Bank12_U_Amp#1_1: U_Bank12 (IC6_U_Bank12.2 IC6_U_Bank12.6), U_Bank12/U_Amp (IC5_U_Bank12_U_Amp#1.1), U_Bank12/U_Amp (IC5_U_Bank12_U_Amp#2.1), U_Bank12/U_Amp (IC5_U_Bank12_U_Amp#3.1), U_Bank12/U_Amp (IC5_U_Bank12_U_Amp#4.1), U_Bank12/U_Amp (IC5_U_Bank12_U_Amp#5.1)
NetIC5_U_Bank13_U_Amp#1_1: U_Bank13 (IC6_U_Bank13.2 IC6_U_Bank13.6), U_Bank13/U_Amp (IC5_U_Bank13_U_Amp#1.1), U_Bank13/U_Amp (IC5_U_Bank13_U_Amp#2.1), U_Bank13/U_Amp (IC5_U_Bank13_U_Amp#3.1), U_Bank13/U_Amp (IC5_U_Bank13_U_Amp#4.1), U_Bank13/U_Amp (IC5_U_Bank13_U_Amp#5.1)
NetIC5_U_Bank14_U_Amp#1_1: U_Bank14 (IC6_U_Bank14.2 IC6_U_Bank14.6), U_Bank14/U_Amp (IC5_U_Bank14_U_Amp#1.1), U_Bank14/U_Amp (IC5_U_Bank14_U_Amp#2.1), U_Bank14/U_Amp (IC5_U_Bank14_U_Amp#3.1), U_Bank14/U_Amp (IC5_U_Bank14_U_Amp#4.1), U_Bank14/U_Amp (IC5_U_Bank14_U_Amp#5.1)
NetIC5_U_Bank15_U_Amp#1_1: U_Bank15 (IC6_U_Bank15.2 IC6_U_Bank15.6), U_Bank15/U_Amp (IC5_U_Bank15_U_Amp#1.1), U_Bank15/U_Amp (IC5_U_Bank15_U_Amp#2.1), U_Bank15/U_Amp (IC5_U_Bank15_U_Amp#3.1), U_Bank15/U_Amp (IC5_U_Bank15_U_Amp#4.1), U_Bank15/U_Amp (IC5_U_Bank15_U_Amp#5.1)
NetIC5_U_Bank16_U_Amp#1_1: U_Bank16 (IC6_U_Bank16.2 IC6_U_Bank16.6), U_Bank16/U_Amp (IC5_U_Bank16_U_Amp#1.1), U_Bank16/U_Amp (IC5_U_Bank16_U_Amp#2.1), U_Bank16/U_Amp (IC5_U_Bank16_U_Amp#3.1), U_Bank16/U_Amp (IC5_U_Bank16_U_Amp#4.1), U_Bank16/U_Amp (IC5_U_Bank16_U_Amp#5.1)
NetIC5_U_Bank17_U_Amp#1_1: U_Bank17 (IC6_U_Bank17.2 IC6_U_Bank17.6), U_Bank17/U_Amp (IC5_U_Bank17_U_Amp#1.1), U_Bank17/U_Amp (IC5_U_Bank17_U_Amp#2.1), U_Bank17/U_Amp (IC5_U_Bank17_U_Amp#3.1), U_Bank17/U_Amp (IC5_U_Bank17_U_Amp#4.1), U_Bank17/U_Amp (IC5_U_Bank17_U_Amp#5.1)
NetIC5_U_Bank18_U_Amp#1_1: U_Bank18 (IC6_U_Bank18.2 IC6_U_Bank18.6), U_Bank18/U_Amp (IC5_U_Bank18_U_Amp#1.1), U_Bank18/U_Amp (IC5_U_Bank18_U_Amp#2.1), U_Bank18/U_Amp (IC5_U_Bank18_U_Amp#3.1), U_Bank18/U_Amp (IC5_U_Bank18_U_Amp#4.1), U_Bank18/U_Amp (IC5_U_Bank18_U_Amp#5.1)
NetIC5_U_Bank19_U_Amp#1_1: U_Bank19 (IC6_U_Bank19.2 IC6_U_Bank19.6), U_Bank19/U_Amp (IC5_U_Bank19_U_Amp#1.1), U_Bank19/U_Amp (IC5_U_Bank19_U_Amp#2.1), U_Bank19/U_Amp (IC5_U_Bank19_U_Amp#3.1), U_Bank19/U_Amp (IC5_U_Bank19_U_Amp#4.1), U_Bank19/U_Amp (IC5_U_Bank19_U_Amp#5.1)
NetIC5_U_Bank20_U_Amp#1_1: U_Bank20 (IC6_U_Bank20.2 IC6_U_Bank20.6), U_Bank20/U_Amp (IC5_U_Bank20_U_Amp#1.1), U_Bank20/U_Amp (IC5_U_Bank20_U_Amp#2.1), U_Bank20/U_Amp (IC5_U_Bank20_U_Amp#3.1), U_Bank20/U_Amp (IC5_U_Bank20_U_Amp#4.1), U_Bank20/U_Amp (IC5_U_Bank20_U_Amp#5.1)
NetP1_2: Main (P1.2 R16.1), U_Bank1/U_Amp (R19_U_Bank1_U_Amp#1.1), U_Bank1/U_Amp (R19_U_Bank1_U_Amp#2.1), U_Bank1/U_Amp (R19_U_Bank1_U_Amp#3.1), U_Bank1/U_Amp (R19_U_Bank1_U_Amp#4.1), U_Bank1/U_Amp (R19_U_Bank1_U_Amp#5.1), U_Bank2/U_Amp (R19_U_Bank2_U_Amp#1.1), U_Bank2/U_Amp (R19_U_Bank2_U_Amp#2.1), U_Bank2/U_Amp (R19_U_Bank2_U_Amp#3.1), U_Bank2/U_Amp (R19_U_Bank2_U_Amp#4.1), U_Bank2/U_Amp (R19_U_Bank2_U_Amp#5.1), U_Bank3/U_Amp (R19_U_Bank3_U_Amp#1.1), U_Bank3/U_Amp (R19_U_Bank3_U_Amp#2.1), U_Bank3/U_Amp (R19_U_Bank3_U_Amp#3.1), U_Bank3/U_Amp (R19_U_Bank3_U_Amp#4.1), U_Bank3/U_Amp (R19_U_Bank3_U_Amp#5.1), U_Bank4/U_Amp (R19_U_Bank4_U_Amp#1.1), U_Bank4/U_Amp (R19_U_Bank4_U_Amp#2.1), U_Bank4/U_Amp (R19_U_Bank4_U_Amp#3.1), U_Bank4/U_Amp (R19_U_Bank4_U_Amp#4.1), U_Bank4/U_Amp (R19_U_Bank4_U_Amp#5.1), U_Bank5/U_Amp (R19_U_Bank5_U_Amp#1.1), U_Bank5/U_Amp (R19_U_Bank5_U_Amp#2.1), U_Bank5/U_Amp (R19_U_Bank5_U_Amp#3.1), U_Bank5/U_Amp (R19_U_Bank5_U_Amp#4.1), U_Bank5/U_Amp (R19_U_Bank5_U_Amp#5.1), U_Bank6/U_Amp (R19_U_Bank6_U_Amp#1.1), U_Bank6/U_Amp (R19_U_Bank6_U_Amp#2.1), U_Bank6/U_Amp (R19_U_Bank6_U_Amp#3.1), U_Bank6/U_Amp (R19_U_Bank6_U_Amp#4.1), U_Bank6/U_Amp (R19_U_Bank6_U_Amp#5.1), U_Bank7/U_Amp (R19_U_Bank7_U_Amp#1.1), U_Bank7/U_Amp (R19_U_Bank7_U_Amp#2.1), U_Bank7/U_Amp (R19_U_Bank7_U_Amp#3.1), U_Bank7/U_Amp (R19_U_Bank7_U_Amp#4.1), U_Bank7/U_Amp (R19_U_Bank7_U_Amp#5.1), U_Bank8/U_Amp (R19_U_Bank8_U_Amp#1.1), U_Bank8/U_Amp (R19_U_Bank8_U_Amp#2.1), U_Bank8/U_Amp (R19_U_Bank8_U_Amp#3.1), U_Bank8/U_Amp (R19_U_Bank8_U_Amp#4.1), U_Bank8/U_Amp (R19_U_Bank8_U_Amp#5.1), U_Bank9/U_Amp (R19_U_Bank9_U_Amp#1.1), U_Bank9/U_Amp (R19_U_Bank9_U_Amp#2.1), U_Bank9/U_Amp (R19_U_Bank9_U_Amp#3.1), U_Bank9/U_Amp (R19_U_Bank9_U_Amp#4.1), U_Bank9/U_Amp (R19_U_Bank9_U_Amp#5.1), U_Bank10/U_Amp (R19_U_Bank10_U_Amp#1.1), U_Bank10/U_Amp (R19_U_Bank10_U_Amp#2.1), U_Bank10/U_Amp (R19_U_Bank10_U_Amp#3.1), U_Bank10/U_Amp (R19_U_Bank10_U_Amp#4.1), U_Bank10/U_Amp (R19_U_Bank10_U_Amp#5.1), U_Bank11/U_Amp (R19_U_Bank11_U_Amp#1.1), U_Bank11/U_Amp (R19_U_Bank11_U_Amp#2.1), U_Bank11/U_Amp (R19_U_Bank11_U_Amp#3.1), U_Bank11/U_Amp (R19_U_Bank11_U_Amp#4.1), U_Bank11/U_Amp (R19_U_Bank11_U_Amp#5.1), U_Bank12/U_Amp (R19_U_Bank12_U_Amp#1.1), U_Bank12/U_Amp (R19_U_Bank12_U_Amp#2.1), U_Bank12/U_Amp (R19_U_Bank12_U_Amp#3.1), U_Bank12/U_Amp (R19_U_Bank12_U_Amp#4.1), U_Bank12/U_Amp (R19_U_Bank12_U_Amp#5.1), U_Bank13/U_Amp (R19_U_Bank13_U_Amp#1.1), U_Bank13/U_Amp (R19_U_Bank13_U_Amp#2.1), U_Bank13/U_Amp (R19_U_Bank13_U_Amp#3.1), U_Bank13/U_Amp (R19_U_Bank13_U_Amp#4.1), U_Bank13/U_Amp (R19_U_Bank13_U_Amp#5.1), U_Bank14/U_Amp (R19_U_Bank14_U_Amp#1.1), U_Bank14/U_Amp (R19_U_Bank14_U_Amp#2.1), U_Bank14/U_Amp (R19_U_Bank14_U_Amp#3.1), U_Bank14/U_Amp (R19_U_Bank14_U_Amp#4.1), U_Bank14/U_Amp (R19_U_Bank14_U_Amp#5.1), U_Bank15/U_Amp (R19_U_Bank15_U_Amp#1.1), U_Bank15/U_Amp (R19_U_Bank15_U_Amp#2.1), U_Bank15/U_Amp (R19_U_Bank15_U_Amp#3.1), U_Bank15/U_Amp (R19_U_Bank15_U_Amp#4.1), U_Bank15/U_Amp (R19_U_Bank15_U_Amp#5.1), U_Bank16/U_Amp (R19_U_Bank16_U_Amp#1.1), U_Bank16/U_Amp (R19_U_Bank16_U_Amp#2.1), U_Bank16/U_Amp (R19_U_Bank16_U_Amp#3.1), U_Bank16/U_Amp (R19_U_Bank16_U_Amp#4.1), U_Bank16/U_Amp (R19_U_Bank16_U_Amp#5.1), U_Bank17/U_Amp (R19_U_Bank17_U_Amp#1.1), U_Bank17/U_Amp (R19_U_Bank17_U_Amp#2.1), U_Bank17/U_Amp (R19_U_Bank17_U_Amp#3.1), U_Bank17/U_Amp (R19_U_Bank17_U_Amp#4.1), U_Bank17/U_Amp (R19_U_Bank17_U_Amp#5.1), U_Bank18/U_Amp (R19_U_Bank18_U_Amp#1.1), U_Bank18/U_Amp (R19_U_Bank18_U_Amp#2.1), U_Bank18/U_Amp (R19_U_Bank18_U_Amp#3.1), U_Bank18/U_Amp (R19_U_Bank18_U_Amp#4.1), U_Bank18/U_Amp (R19_U_Bank18_U_Amp#5.1), U_Bank19/U_Amp (R19_U_Bank19_U_Amp#1.1), U_Bank19/U_Amp (R19_U_Bank19_U_Amp#2.1), U_Bank19/U_Amp (R19_U_Bank19_U_Amp#3.1), U_Bank19/U_Amp (R19_U_Bank19_U_Amp#4.1), U_Bank19/U_Amp (R19_U_Bank19_U_Amp#5.1), U_Bank20/U_Amp (R19_U_Bank20_U_Amp#1.1), U_Bank20/U_Amp (R19_U_Bank20_U_Amp#2.1), U_Bank20/U_Amp (R19_U_Bank20_U_Amp#3.1), U_Bank20/U_Amp (R19_U_Bank20_U_Amp#4.1), U_Bank20/U_Amp (R19_U_Bank20_U_Amp#5.1)
NetR12_U_Bank1_1: Main (R17.1 R18.2), U_Bank1 (R12_U_Bank1.1), U_Bank2 (R12_U_Bank2.1), U_Bank3 (R12_U_Bank3.1), U_Bank4 (R12_U_Bank4.1), U_Bank5 (R12_U_Bank5.1), U_Bank6 (R12_U_Bank6.1), U_Bank7 (R12_U_Bank7.1), U_Bank8 (R12_U_Bank8.1), U_Bank9 (R12_U_Bank9.1), U_Bank10 (R12_U_Bank10.1), U_Bank11 (R12_U_Bank11.1), U_Bank12 (R12_U_Bank12.1), U_Bank13 (R12_U_Bank13.1), U_Bank14 (R12_U_Bank14.1), U_Bank15 (R12_U_Bank15.1), U_Bank16 (R12_U_Bank16.1), U_Bank17 (R12_U_Bank17.1), U_Bank18 (R12_U_Bank18.1), U_Bank19 (R12_U_Bank19.1), U_Bank20 (R12_U_Bank20.1)
OUT_A_N_U_Bank1: U_Bank1 (J1_U_Bank1.3), U_Bank1/U_Amp (R10_U_Amp5.2)
OUT_A_N_U_Bank2: U_Bank2 (J1_U_Bank2.3), U_Bank2/U_Amp (R10_U_Bank2_U_Amp#1.2)
OUT_A_N_U_Bank3: U_Bank3 (J1_U_Bank3.3), U_Bank3/U_Amp (R10_U_Bank3_U_Amp#1.2)
OUT_A_N_U_Bank4: U_Bank4 (J1_U_Bank4.3), U_Bank4/U_Amp (R10_U_Bank4_U_Amp#1.2)
OUT_A_N_U_Bank5: U_Bank5 (J1_U_Bank5.3), U_Bank5/U_Amp (R10_U_Bank5_U_Amp#1.2)
OUT_A_N_U_Bank6: U_Bank6 (J1_U_Bank6.3), U_Bank6/U_Amp (R10_U_Bank6_U_Amp#1.2)
OUT_A_N_U_Bank7: U_Bank7 (J1_U_Bank7.3), U_Bank7/U_Amp (R10_U_Bank7_U_Amp#1.2)
OUT_A_N_U_Bank8: U_Bank8 (J1_U_Bank8.3), U_Bank8/U_Amp (R10_U_Bank8_U_Amp#1.2)
OUT_A_N_U_Bank9: U_Bank9 (J1_U_Bank9.3), U_Bank9/U_Amp (R10_U_Bank9_U_Amp#1.2)
OUT_A_N_U_Bank10: U_Bank10 (J1_U_Bank10.3), U_Bank10/U_Amp (R10_U_Bank10_U_Amp#1.2)
OUT_A_N_U_Bank11: U_Bank11 (J1_U_Bank11.3), U_Bank11/U_Amp (R10_U_Bank11_U_Amp#1.2)
OUT_A_N_U_Bank12: U_Bank12 (J1_U_Bank12.3), U_Bank12/U_Amp (R10_U_Bank12_U_Amp#1.2)
OUT_A_N_U_Bank13: U_Bank13 (J1_U_Bank13.3), U_Bank13/U_Amp (R10_U_Bank13_U_Amp#1.2)
OUT_A_N_U_Bank14: U_Bank14 (J1_U_Bank14.3), U_Bank14/U_Amp (R10_U_Bank14_U_Amp#1.2)
OUT_A_N_U_Bank15: U_Bank15 (J1_U_Bank15.3), U_Bank15/U_Amp (R10_U_Bank15_U_Amp#1.2)
OUT_A_N_U_Bank16: U_Bank16 (J1_U_Bank16.3), U_Bank16/U_Amp (R10_U_Bank16_U_Amp#1.2)
OUT_A_N_U_Bank17: U_Bank17 (J1_U_Bank17.3), U_Bank17/U_Amp (R10_U_Bank17_U_Amp#1.2)
OUT_A_N_U_Bank18: U_Bank18 (J1_U_Bank18.3), U_Bank18/U_Amp (R10_U_Bank18_U_Amp#1.2)
OUT_A_N_U_Bank19: U_Bank19 (J1_U_Bank19.3), U_Bank19/U_Amp (R10_U_Bank19_U_Amp#1.2)
OUT_A_N_U_Bank20: U_Bank20 (J1_U_Bank20.3), U_Bank20/U_Amp (R10_U_Bank20_U_Amp#1.2)
OUT_A_P_U_Bank1: U_Bank1 (J1_U_Bank1.1), U_Bank1/U_Amp (R11_U_Amp5.2)
OUT_A_P_U_Bank2: U_Bank2 (J1_U_Bank2.1), U_Bank2/U_Amp (R11_U_Bank2_U_Amp#1.2)
OUT_A_P_U_Bank3: U_Bank3 (J1_U_Bank3.1), U_Bank3/U_Amp (R11_U_Bank3_U_Amp#1.2)
OUT_A_P_U_Bank4: U_Bank4 (J1_U_Bank4.1), U_Bank4/U_Amp (R11_U_Bank4_U_Amp#1.2)
OUT_A_P_U_Bank5: U_Bank5 (J1_U_Bank5.1), U_Bank5/U_Amp (R11_U_Bank5_U_Amp#1.2)
OUT_A_P_U_Bank6: U_Bank6 (J1_U_Bank6.1), U_Bank6/U_Amp (R11_U_Bank6_U_Amp#1.2)
OUT_A_P_U_Bank7: U_Bank7 (J1_U_Bank7.1), U_Bank7/U_Amp (R11_U_Bank7_U_Amp#1.2)
OUT_A_P_U_Bank8: U_Bank8 (J1_U_Bank8.1), U_Bank8/U_Amp (R11_U_Bank8_U_Amp#1.2)
OUT_A_P_U_Bank9: U_Bank9 (J1_U_Bank9.1), U_Bank9/U_Amp (R11_U_Bank9_U_Amp#1.2)
OUT_A_P_U_Bank10: U_Bank10 (J1_U_Bank10.1), U_Bank10/U_Amp (R11_U_Bank10_U_Amp#1.2)
OUT_A_P_U_Bank11: U_Bank11 (J1_U_Bank11.1), U_Bank11/U_Amp (R11_U_Bank11_U_Amp#1.2)
OUT_A_P_U_Bank12: U_Bank12 (J1_U_Bank12.1), U_Bank12/U_Amp (R11_U_Bank12_U_Amp#1.2)
OUT_A_P_U_Bank13: U_Bank13 (J1_U_Bank13.1), U_Bank13/U_Amp (R11_U_Bank13_U_Amp#1.2)
OUT_A_P_U_Bank14: U_Bank14 (J1_U_Bank14.1), U_Bank14/U_Amp (R11_U_Bank14_U_Amp#1.2)
OUT_A_P_U_Bank15: U_Bank15 (J1_U_Bank15.1), U_Bank15/U_Amp (R11_U_Bank15_U_Amp#1.2)
OUT_A_P_U_Bank16: U_Bank16 (J1_U_Bank16.1), U_Bank16/U_Amp (R11_U_Bank16_U_Amp#1.2)
OUT_A_P_U_Bank17: U_Bank17 (J1_U_Bank17.1), U_Bank17/U_Amp (R11_U_Bank17_U_Amp#1.2)
OUT_A_P_U_Bank18: U_Bank18 (J1_U_Bank18.1), U_Bank18/U_Amp (R11_U_Bank18_U_Amp#1.2)
OUT_A_P_U_Bank19: U_Bank19 (J1_U_Bank19.1), U_Bank19/U_Amp (R11_U_Bank19_U_Amp#1.2)
OUT_A_P_U_Bank20: U_Bank20 (J1_U_Bank20.1), U_Bank20/U_Amp (R11_U_Bank20_U_Amp#1.2)
OUT_B_N_U_Bank1: U_Bank1 (J1_U_Bank1.6), U_Bank1/U_Amp (R10_U_Amp4.2)
OUT_B_N_U_Bank2: U_Bank2 (J1_U_Bank2.6), U_Bank2/U_Amp (R10_U_Bank2_U_Amp#2.2)
OUT_B_N_U_Bank3: U_Bank3 (J1_U_Bank3.6), U_Bank3/U_Amp (R10_U_Bank3_U_Amp#2.2)
OUT_B_N_U_Bank4: U_Bank4 (J1_U_Bank4.6), U_Bank4/U_Amp (R10_U_Bank4_U_Amp#2.2)
OUT_B_N_U_Bank5: U_Bank5 (J1_U_Bank5.6), U_Bank5/U_Amp (R10_U_Bank5_U_Amp#2.2)
OUT_B_N_U_Bank6: U_Bank6 (J1_U_Bank6.6), U_Bank6/U_Amp (R10_U_Bank6_U_Amp#2.2)
OUT_B_N_U_Bank7: U_Bank7 (J1_U_Bank7.6), U_Bank7/U_Amp (R10_U_Bank7_U_Amp#2.2)
OUT_B_N_U_Bank8: U_Bank8 (J1_U_Bank8.6), U_Bank8/U_Amp (R10_U_Bank8_U_Amp#2.2)
OUT_B_N_U_Bank9: U_Bank9 (J1_U_Bank9.6), U_Bank9/U_Amp (R10_U_Bank9_U_Amp#2.2)
OUT_B_N_U_Bank10: U_Bank10 (J1_U_Bank10.6), U_Bank10/U_Amp (R10_U_Bank10_U_Amp#2.2)
OUT_B_N_U_Bank11: U_Bank11 (J1_U_Bank11.6), U_Bank11/U_Amp (R10_U_Bank11_U_Amp#2.2)
OUT_B_N_U_Bank12: U_Bank12 (J1_U_Bank12.6), U_Bank12/U_Amp (R10_U_Bank12_U_Amp#2.2)
OUT_B_N_U_Bank13: U_Bank13 (J1_U_Bank13.6), U_Bank13/U_Amp (R10_U_Bank13_U_Amp#2.2)
OUT_B_N_U_Bank14: U_Bank14 (J1_U_Bank14.6), U_Bank14/U_Amp (R10_U_Bank14_U_Amp#2.2)
OUT_B_N_U_Bank15: U_Bank15 (J1_U_Bank15.6), U_Bank15/U_Amp (R10_U_Bank15_U_Amp#2.2)
OUT_B_N_U_Bank16: U_Bank16 (J1_U_Bank16.6), U_Bank16/U_Amp (R10_U_Bank16_U_Amp#2.2)
OUT_B_N_U_Bank17: U_Bank17 (J1_U_Bank17.6), U_Bank17/U_Amp (R10_U_Bank17_U_Amp#2.2)
OUT_B_N_U_Bank18: U_Bank18 (J1_U_Bank18.6), U_Bank18/U_Amp (R10_U_Bank18_U_Amp#2.2)
OUT_B_N_U_Bank19: U_Bank19 (J1_U_Bank19.6), U_Bank19/U_Amp (R10_U_Bank19_U_Amp#2.2)
OUT_B_N_U_Bank20: U_Bank20 (J1_U_Bank20.6), U_Bank20/U_Amp (R10_U_Bank20_U_Amp#2.2)
OUT_B_P_U_Bank1: U_Bank1 (J1_U_Bank1.4), U_Bank1/U_Amp (R11_U_Amp4.2)
OUT_B_P_U_Bank2: U_Bank2 (J1_U_Bank2.4), U_Bank2/U_Amp (R11_U_Bank2_U_Amp#2.2)
OUT_B_P_U_Bank3: U_Bank3 (J1_U_Bank3.4), U_Bank3/U_Amp (R11_U_Bank3_U_Amp#2.2)
OUT_B_P_U_Bank4: U_Bank4 (J1_U_Bank4.4), U_Bank4/U_Amp (R11_U_Bank4_U_Amp#2.2)
OUT_B_P_U_Bank5: U_Bank5 (J1_U_Bank5.4), U_Bank5/U_Amp (R11_U_Bank5_U_Amp#2.2)
OUT_B_P_U_Bank6: U_Bank6 (J1_U_Bank6.4), U_Bank6/U_Amp (R11_U_Bank6_U_Amp#2.2)
OUT_B_P_U_Bank7: U_Bank7 (J1_U_Bank7.4), U_Bank7/U_Amp (R11_U_Bank7_U_Amp#2.2)
OUT_B_P_U_Bank8: U_Bank8 (J1_U_Bank8.4), U_Bank8/U_Amp (R11_U_Bank8_U_Amp#2.2)
OUT_B_P_U_Bank9: U_Bank9 (J1_U_Bank9.4), U_Bank9/U_Amp (R11_U_Bank9_U_Amp#2.2)
OUT_B_P_U_Bank10: U_Bank10 (J1_U_Bank10.4), U_Bank10/U_Amp (R11_U_Bank10_U_Amp#2.2)
OUT_B_P_U_Bank11: U_Bank11 (J1_U_Bank11.4), U_Bank11/U_Amp (R11_U_Bank11_U_Amp#2.2)
OUT_B_P_U_Bank12: U_Bank12 (J1_U_Bank12.4), U_Bank12/U_Amp (R11_U_Bank12_U_Amp#2.2)
OUT_B_P_U_Bank13: U_Bank13 (J1_U_Bank13.4), U_Bank13/U_Amp (R11_U_Bank13_U_Amp#2.2)
OUT_B_P_U_Bank14: U_Bank14 (J1_U_Bank14.4), U_Bank14/U_Amp (R11_U_Bank14_U_Amp#2.2)
OUT_B_P_U_Bank15: U_Bank15 (J1_U_Bank15.4), U_Bank15/U_Amp (R11_U_Bank15_U_Amp#2.2)
OUT_B_P_U_Bank16: U_Bank16 (J1_U_Bank16.4), U_Bank16/U_Amp (R11_U_Bank16_U_Amp#2.2)
OUT_B_P_U_Bank17: U_Bank17 (J1_U_Bank17.4), U_Bank17/U_Amp (R11_U_Bank17_U_Amp#2.2)
OUT_B_P_U_Bank18: U_Bank18 (J1_U_Bank18.4), U_Bank18/U_Amp (R11_U_Bank18_U_Amp#2.2)
OUT_B_P_U_Bank19: U_Bank19 (J1_U_Bank19.4), U_Bank19/U_Amp (R11_U_Bank19_U_Amp#2.2)
OUT_B_P_U_Bank20: U_Bank20 (J1_U_Bank20.4), U_Bank20/U_Amp (R11_U_Bank20_U_Amp#2.2)
OUT_C_N_U_Bank1: U_Bank1 (J1_U_Bank1.9), U_Bank1/U_Amp (R10_U_Amp3.2)
OUT_C_N_U_Bank2: U_Bank2 (J1_U_Bank2.9), U_Bank2/U_Amp (R10_U_Bank2_U_Amp#3.2)
OUT_C_N_U_Bank3: U_Bank3 (J1_U_Bank3.9), U_Bank3/U_Amp (R10_U_Bank3_U_Amp#3.2)
OUT_C_N_U_Bank4: U_Bank4 (J1_U_Bank4.9), U_Bank4/U_Amp (R10_U_Bank4_U_Amp#3.2)
OUT_C_N_U_Bank5: U_Bank5 (J1_U_Bank5.9), U_Bank5/U_Amp (R10_U_Bank5_U_Amp#3.2)
OUT_C_N_U_Bank6: U_Bank6 (J1_U_Bank6.9), U_Bank6/U_Amp (R10_U_Bank6_U_Amp#3.2)
OUT_C_N_U_Bank7: U_Bank7 (J1_U_Bank7.9), U_Bank7/U_Amp (R10_U_Bank7_U_Amp#3.2)
OUT_C_N_U_Bank8: U_Bank8 (J1_U_Bank8.9), U_Bank8/U_Amp (R10_U_Bank8_U_Amp#3.2)
OUT_C_N_U_Bank9: U_Bank9 (J1_U_Bank9.9), U_Bank9/U_Amp (R10_U_Bank9_U_Amp#3.2)
OUT_C_N_U_Bank10: U_Bank10 (J1_U_Bank10.9), U_Bank10/U_Amp (R10_U_Bank10_U_Amp#3.2)
OUT_C_N_U_Bank11: U_Bank11 (J1_U_Bank11.9), U_Bank11/U_Amp (R10_U_Bank11_U_Amp#3.2)
OUT_C_N_U_Bank12: U_Bank12 (J1_U_Bank12.9), U_Bank12/U_Amp (R10_U_Bank12_U_Amp#3.2)
OUT_C_N_U_Bank13: U_Bank13 (J1_U_Bank13.9), U_Bank13/U_Amp (R10_U_Bank13_U_Amp#3.2)
OUT_C_N_U_Bank14: U_Bank14 (J1_U_Bank14.9), U_Bank14/U_Amp (R10_U_Bank14_U_Amp#3.2)
OUT_C_N_U_Bank15: U_Bank15 (J1_U_Bank15.9), U_Bank15/U_Amp (R10_U_Bank15_U_Amp#3.2)
OUT_C_N_U_Bank16: U_Bank16 (J1_U_Bank16.9), U_Bank16/U_Amp (R10_U_Bank16_U_Amp#3.2)
OUT_C_N_U_Bank17: U_Bank17 (J1_U_Bank17.9), U_Bank17/U_Amp (R10_U_Bank17_U_Amp#3.2)
OUT_C_N_U_Bank18: U_Bank18 (J1_U_Bank18.9), U_Bank18/U_Amp (R10_U_Bank18_U_Amp#3.2)
OUT_C_N_U_Bank19: U_Bank19 (J1_U_Bank19.9), U_Bank19/U_Amp (R10_U_Bank19_U_Amp#3.2)
OUT_C_N_U_Bank20: U_Bank20 (J1_U_Bank20.9), U_Bank20/U_Amp (R10_U_Bank20_U_Amp#3.2)
OUT_C_P_U_Bank1: U_Bank1 (J1_U_Bank1.7), U_Bank1/U_Amp (R11_U_Amp3.2)
OUT_C_P_U_Bank2: U_Bank2 (J1_U_Bank2.7), U_Bank2/U_Amp (R11_U_Bank2_U_Amp#3.2)
OUT_C_P_U_Bank3: U_Bank3 (J1_U_Bank3.7), U_Bank3/U_Amp (R11_U_Bank3_U_Amp#3.2)
OUT_C_P_U_Bank4: U_Bank4 (J1_U_Bank4.7), U_Bank4/U_Amp (R11_U_Bank4_U_Amp#3.2)
OUT_C_P_U_Bank5: U_Bank5 (J1_U_Bank5.7), U_Bank5/U_Amp (R11_U_Bank5_U_Amp#3.2)
OUT_C_P_U_Bank6: U_Bank6 (J1_U_Bank6.7), U_Bank6/U_Amp (R11_U_Bank6_U_Amp#3.2)
OUT_C_P_U_Bank7: U_Bank7 (J1_U_Bank7.7), U_Bank7/U_Amp (R11_U_Bank7_U_Amp#3.2)
OUT_C_P_U_Bank8: U_Bank8 (J1_U_Bank8.7), U_Bank8/U_Amp (R11_U_Bank8_U_Amp#3.2)
OUT_C_P_U_Bank9: U_Bank9 (J1_U_Bank9.7), U_Bank9/U_Amp (R11_U_Bank9_U_Amp#3.2)
OUT_C_P_U_Bank10: U_Bank10 (J1_U_Bank10.7), U_Bank10/U_Amp (R11_U_Bank10_U_Amp#3.2)
OUT_C_P_U_Bank11: U_Bank11 (J1_U_Bank11.7), U_Bank11/U_Amp (R11_U_Bank11_U_Amp#3.2)
OUT_C_P_U_Bank12: U_Bank12 (J1_U_Bank12.7), U_Bank12/U_Amp (R11_U_Bank12_U_Amp#3.2)
OUT_C_P_U_Bank13: U_Bank13 (J1_U_Bank13.7), U_Bank13/U_Amp (R11_U_Bank13_U_Amp#3.2)
OUT_C_P_U_Bank14: U_Bank14 (J1_U_Bank14.7), U_Bank14/U_Amp (R11_U_Bank14_U_Amp#3.2)
OUT_C_P_U_Bank15: U_Bank15 (J1_U_Bank15.7), U_Bank15/U_Amp (R11_U_Bank15_U_Amp#3.2)
OUT_C_P_U_Bank16: U_Bank16 (J1_U_Bank16.7), U_Bank16/U_Amp (R11_U_Bank16_U_Amp#3.2)
OUT_C_P_U_Bank17: U_Bank17 (J1_U_Bank17.7), U_Bank17/U_Amp (R11_U_Bank17_U_Amp#3.2)
OUT_C_P_U_Bank18: U_Bank18 (J1_U_Bank18.7), U_Bank18/U_Amp (R11_U_Bank18_U_Amp#3.2)
OUT_C_P_U_Bank19: U_Bank19 (J1_U_Bank19.7), U_Bank19/U_Amp (R11_U_Bank19_U_Amp#3.2)
OUT_C_P_U_Bank20: U_Bank20 (J1_U_Bank20.7), U_Bank20/U_Amp (R11_U_Bank20_U_Amp#3.2)
OUT_D_N_U_Bank1: U_Bank1 (J1_U_Bank1.12), U_Bank1/U_Amp (R10_U_Amp2.2)
OUT_D_N_U_Bank2: U_Bank2 (J1_U_Bank2.12), U_Bank2/U_Amp (R10_U_Bank2_U_Amp#4.2)
OUT_D_N_U_Bank3: U_Bank3 (J1_U_Bank3.12), U_Bank3/U_Amp (R10_U_Bank3_U_Amp#4.2)
OUT_D_N_U_Bank4: U_Bank4 (J1_U_Bank4.12), U_Bank4/U_Amp (R10_U_Bank4_U_Amp#4.2)
OUT_D_N_U_Bank5: U_Bank5 (J1_U_Bank5.12), U_Bank5/U_Amp (R10_U_Bank5_U_Amp#4.2)
OUT_D_N_U_Bank6: U_Bank6 (J1_U_Bank6.12), U_Bank6/U_Amp (R10_U_Bank6_U_Amp#4.2)
OUT_D_N_U_Bank7: U_Bank7 (J1_U_Bank7.12), U_Bank7/U_Amp (R10_U_Bank7_U_Amp#4.2)
OUT_D_N_U_Bank8: U_Bank8 (J1_U_Bank8.12), U_Bank8/U_Amp (R10_U_Bank8_U_Amp#4.2)
OUT_D_N_U_Bank9: U_Bank9 (J1_U_Bank9.12), U_Bank9/U_Amp (R10_U_Bank9_U_Amp#4.2)
OUT_D_N_U_Bank10: U_Bank10 (J1_U_Bank10.12), U_Bank10/U_Amp (R10_U_Bank10_U_Amp#4.2)
OUT_D_N_U_Bank11: U_Bank11 (J1_U_Bank11.12), U_Bank11/U_Amp (R10_U_Bank11_U_Amp#4.2)
OUT_D_N_U_Bank12: U_Bank12 (J1_U_Bank12.12), U_Bank12/U_Amp (R10_U_Bank12_U_Amp#4.2)
OUT_D_N_U_Bank13: U_Bank13 (J1_U_Bank13.12), U_Bank13/U_Amp (R10_U_Bank13_U_Amp#4.2)
OUT_D_N_U_Bank14: U_Bank14 (J1_U_Bank14.12), U_Bank14/U_Amp (R10_U_Bank14_U_Amp#4.2)
OUT_D_N_U_Bank15: U_Bank15 (J1_U_Bank15.12), U_Bank15/U_Amp (R10_U_Bank15_U_Amp#4.2)
OUT_D_N_U_Bank16: U_Bank16 (J1_U_Bank16.12), U_Bank16/U_Amp (R10_U_Bank16_U_Amp#4.2)
OUT_D_N_U_Bank17: U_Bank17 (J1_U_Bank17.12), U_Bank17/U_Amp (R10_U_Bank17_U_Amp#4.2)
OUT_D_N_U_Bank18: U_Bank18 (J1_U_Bank18.12), U_Bank18/U_Amp (R10_U_Bank18_U_Amp#4.2)
OUT_D_N_U_Bank19: U_Bank19 (J1_U_Bank19.12), U_Bank19/U_Amp (R10_U_Bank19_U_Amp#4.2)
OUT_D_N_U_Bank20: U_Bank20 (J1_U_Bank20.12), U_Bank20/U_Amp (R10_U_Bank20_U_Amp#4.2)
OUT_D_P_U_Bank1: U_Bank1 (J1_U_Bank1.10), U_Bank1/U_Amp (R11_U_Amp2.2)
OUT_D_P_U_Bank2: U_Bank2 (J1_U_Bank2.10), U_Bank2/U_Amp (R11_U_Bank2_U_Amp#4.2)
OUT_D_P_U_Bank3: U_Bank3 (J1_U_Bank3.10), U_Bank3/U_Amp (R11_U_Bank3_U_Amp#4.2)
OUT_D_P_U_Bank4: U_Bank4 (J1_U_Bank4.10), U_Bank4/U_Amp (R11_U_Bank4_U_Amp#4.2)
OUT_D_P_U_Bank5: U_Bank5 (J1_U_Bank5.10), U_Bank5/U_Amp (R11_U_Bank5_U_Amp#4.2)
OUT_D_P_U_Bank6: U_Bank6 (J1_U_Bank6.10), U_Bank6/U_Amp (R11_U_Bank6_U_Amp#4.2)
OUT_D_P_U_Bank7: U_Bank7 (J1_U_Bank7.10), U_Bank7/U_Amp (R11_U_Bank7_U_Amp#4.2)
OUT_D_P_U_Bank8: U_Bank8 (J1_U_Bank8.10), U_Bank8/U_Amp (R11_U_Bank8_U_Amp#4.2)
OUT_D_P_U_Bank9: U_Bank9 (J1_U_Bank9.10), U_Bank9/U_Amp (R11_U_Bank9_U_Amp#4.2)
OUT_D_P_U_Bank10: U_Bank10 (J1_U_Bank10.10), U_Bank10/U_Amp (R11_U_Bank10_U_Amp#4.2)
OUT_D_P_U_Bank11: U_Bank11 (J1_U_Bank11.10), U_Bank11/U_Amp (R11_U_Bank11_U_Amp#4.2)
OUT_D_P_U_Bank12: U_Bank12 (J1_U_Bank12.10), U_Bank12/U_Amp (R11_U_Bank12_U_Amp#4.2)
OUT_D_P_U_Bank13: U_Bank13 (J1_U_Bank13.10), U_Bank13/U_Amp (R11_U_Bank13_U_Amp#4.2)
OUT_D_P_U_Bank14: U_Bank14 (J1_U_Bank14.10), U_Bank14/U_Amp (R11_U_Bank14_U_Amp#4.2)
OUT_D_P_U_Bank15: U_Bank15 (J1_U_Bank15.10), U_Bank15/U_Amp (R11_U_Bank15_U_Amp#4.2)
OUT_D_P_U_Bank16: U_Bank16 (J1_U_Bank16.10), U_Bank16/U_Amp (R11_U_Bank16_U_Amp#4.2)
OUT_D_P_U_Bank17: U_Bank17 (J1_U_Bank17.10), U_Bank17/U_Amp (R11_U_Bank17_U_Amp#4.2)
OUT_D_P_U_Bank18: U_Bank18 (J1_U_Bank18.10), U_Bank18/U_Amp (R11_U_Bank18_U_Amp#4.2)
OUT_D_P_U_Bank19: U_Bank19 (J1_U_Bank19.10), U_Bank19/U_Amp (R11_U_Bank19_U_Amp#4.2)
OUT_D_P_U_Bank20: U_Bank20 (J1_U_Bank20.10), U_Bank20/U_Amp (R11_U_Bank20_U_Amp#4.2)
OUT_E_N_U_Bank1: U_Bank1 (J1_U_Bank1.15), U_Bank1/U_Amp (R10_U_Amp1.2)
OUT_E_N_U_Bank2: U_Bank2 (J1_U_Bank2.15), U_Bank2/U_Amp (R10_U_Bank2_U_Amp#5.2)
OUT_E_N_U_Bank3: U_Bank3 (J1_U_Bank3.15), U_Bank3/U_Amp (R10_U_Bank3_U_Amp#5.2)
OUT_E_N_U_Bank4: U_Bank4 (J1_U_Bank4.15), U_Bank4/U_Amp (R10_U_Bank4_U_Amp#5.2)
OUT_E_N_U_Bank5: U_Bank5 (J1_U_Bank5.15), U_Bank5/U_Amp (R10_U_Bank5_U_Amp#5.2)
OUT_E_N_U_Bank6: U_Bank6 (J1_U_Bank6.15), U_Bank6/U_Amp (R10_U_Bank6_U_Amp#5.2)
OUT_E_N_U_Bank7: U_Bank7 (J1_U_Bank7.15), U_Bank7/U_Amp (R10_U_Bank7_U_Amp#5.2)
OUT_E_N_U_Bank8: U_Bank8 (J1_U_Bank8.15), U_Bank8/U_Amp (R10_U_Bank8_U_Amp#5.2)
OUT_E_N_U_Bank9: U_Bank9 (J1_U_Bank9.15), U_Bank9/U_Amp (R10_U_Bank9_U_Amp#5.2)
OUT_E_N_U_Bank10: U_Bank10 (J1_U_Bank10.15), U_Bank10/U_Amp (R10_U_Bank10_U_Amp#5.2)
OUT_E_N_U_Bank11: U_Bank11 (J1_U_Bank11.15), U_Bank11/U_Amp (R10_U_Bank11_U_Amp#5.2)
OUT_E_N_U_Bank12: U_Bank12 (J1_U_Bank12.15), U_Bank12/U_Amp (R10_U_Bank12_U_Amp#5.2)
OUT_E_N_U_Bank13: U_Bank13 (J1_U_Bank13.15), U_Bank13/U_Amp (R10_U_Bank13_U_Amp#5.2)
OUT_E_N_U_Bank14: U_Bank14 (J1_U_Bank14.15), U_Bank14/U_Amp (R10_U_Bank14_U_Amp#5.2)
OUT_E_N_U_Bank15: U_Bank15 (J1_U_Bank15.15), U_Bank15/U_Amp (R10_U_Bank15_U_Amp#5.2)
OUT_E_N_U_Bank16: U_Bank16 (J1_U_Bank16.15), U_Bank16/U_Amp (R10_U_Bank16_U_Amp#5.2)
OUT_E_N_U_Bank17: U_Bank17 (J1_U_Bank17.15), U_Bank17/U_Amp (R10_U_Bank17_U_Amp#5.2)
OUT_E_N_U_Bank18: U_Bank18 (J1_U_Bank18.15), U_Bank18/U_Amp (R10_U_Bank18_U_Amp#5.2)
OUT_E_N_U_Bank19: U_Bank19 (J1_U_Bank19.15), U_Bank19/U_Amp (R10_U_Bank19_U_Amp#5.2)
OUT_E_N_U_Bank20: U_Bank20 (J1_U_Bank20.15), U_Bank20/U_Amp (R10_U_Bank20_U_Amp#5.2)